# Altium project Animated Archer.PrjPCB (part 1 of 2)
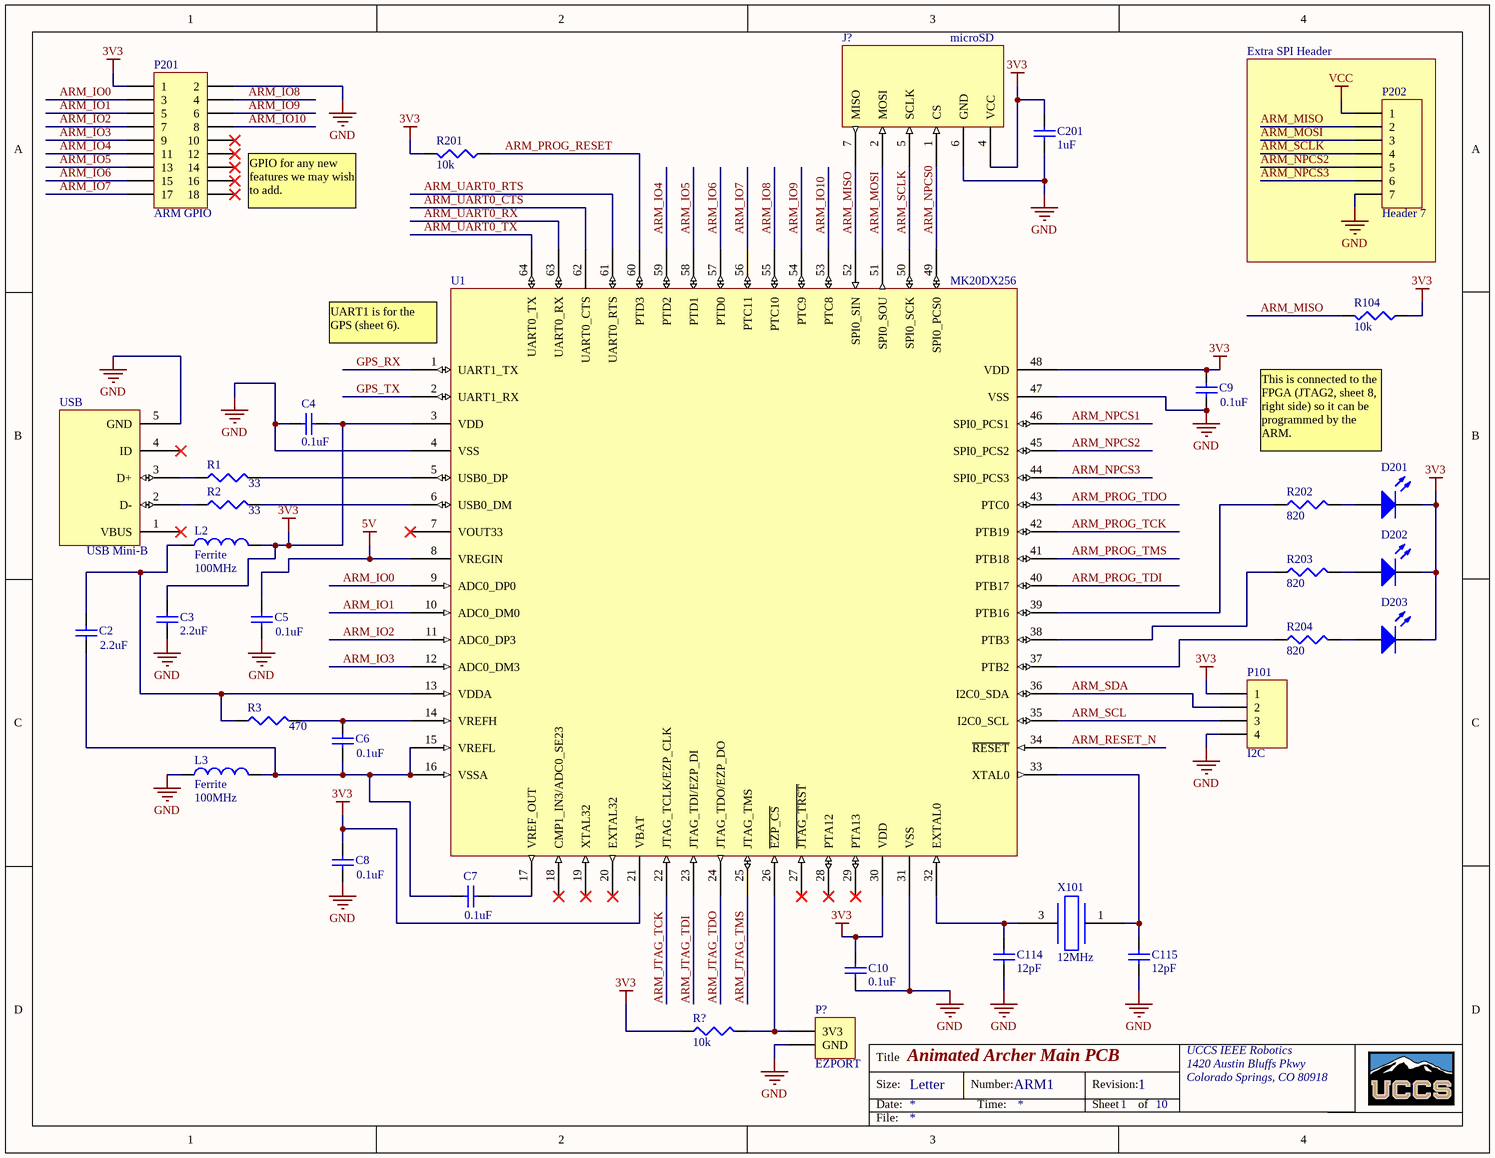
[diagram p0: ARM.SchDoc]
8 sheets, 160 parts. Net scope: global (net labels, ports and power ports of the same name join across sheets).
Board file: Animated Archer Rev1.PcbDoc
Sheets:
  ARM.SchDoc
  FPGA1.SchDoc
  FPGA2.SchDoc
  FPGA3.SchDoc
  JTAG1.SchDoc
  JTAG2.SchDoc
  POWER.SchDoc
  SRAM.SchDoc

## Sheet ARM.SchDoc: Animated Archer Main PCB
size Letter; Author: John Eric Martin; Engineer: John Eric Martin; Organization: UCCS IEEE Robotics; Address1: 1420 Austin Bluffs Pkwy; Address2: Colorado Springs, CO 80918; DocumentNumber: ARM1; Revision: 1; SheetNumber: 1; SheetTotal: 10; ProjectName: Animated Archer Quadcopter

### Parts
C2  value 2.2uF  [C0805]  (hidden comment: Cap Semi)
C3  value 2.2uF  [C0805]  (hidden comment: Cap Semi)
C4  value 0.1uF  [C0805]  (hidden comment: Cap Semi)
C5  value 0.1uF  [C0805]  (hidden comment: Cap Semi)
C6  value 0.1uF  [C0805]  (hidden comment: Cap Semi)
C7  value 0.1uF  [C0805]  (hidden comment: Cap Semi)
C8  value 0.1uF  [C0805]  (hidden comment: Cap Semi)
C9  value 0.1uF  [C0805]  (hidden comment: Cap Semi)
C10  value 0.1uF  [C0805]  (hidden comment: Cap Semi)
C114  value 12pF  [1608[0603]]  (hidden comment: 0.1uF)
C115  value 12pF  [1608[0603]]  (hidden comment: 0.1uF)
C201  value 1uF  [1608[0603]]  (hidden comment: 0.1uF)
D201  Green  [1608[0603]]  (value not drawn)
D202  Green  [1608[0603]]  (value not drawn)
D203  Green  [1608[0603]]  (value not drawn)
J101  microSD  [500873-0806]
L2  Ferrite  value 100MHz  [C0805]
L3  Ferrite  value 100MHz  [C0805]
P101  I2C  [HDR1X4]
P103  EZPORT  [HDR1X2]
P201  ARM GPIO  [HDR2X9]
P202  Header 7  [HDR1X7]
R1  value 33  [6-0805_N]  (hidden comment: Res3)
R2  value 33  [6-0805_N]  (hidden comment: Res3)
R3  value 470  [6-0805_N]  (hidden comment: Res3)
R104  value 10k  [J1-0603]  (hidden comment: Res3)
R106  value 10k  [J1-0603]  (hidden comment: Res3)
R201  value 10k  [J1-0603]  (hidden comment: Res3)
R202  value 820  [J1-0603]  (hidden comment: Res3)
R203  value 820  [J1-0603]  (hidden comment: Res3)
R204  value 820  [J1-0603]  (hidden comment: Res3)
U1  Part Number: MK20DX256  [MK20DX128VLH5]  (hidden comment: MK20DX128VLH5)
USB  USB Mini-B  [54819-0572]
X101  12MHz  [CTS405XTAL]

### Blocks framed on the sheet
Extra SPI Header: P202

### Nets
3V3: C3.2 C4.1 C8.2 C9.2 C10.2 C201.1 D201.2(K) D202.2(K) D203.2(K) J101.4(VCC) L2.2 P101.1 P201.1 R104.1 R106.1 R201.1 U1.3(VDD) U1.21(VBAT) U1.30(VDD) U1.48(VDD)  [project net CPLD_VTARGET]
5V: C5.2 U1.8(VREGIN)
GND: C3.1 C4.2 C5.1 C8.1 C9.1 C10.1 C114.1 C115.1 C201.2 J101.6(GND) L3.1 P101.4 P103.2(GND) P201.2 P202.7 U1.4(VSS) U1.31(VSS) U1.47(VSS) USB.5(GND)  [project net FPGA_SUSPEND]
VCC: P202.1
ARM_IO0: P201.3 U1.9(ADC0_DP0)
ARM_IO1: P201.5 U1.10(ADC0_DM0)
ARM_IO2: P201.7 U1.11(ADC0_DP3)
ARM_IO3: P201.9 U1.12(ADC0_DM3)
ARM_IO4: P201.11 U1.59(PTD2)
ARM_IO5: P201.13 U1.58(PTD1)
ARM_IO6: P201.15 U1.57(PTD0)
ARM_IO7: P201.17 U1.56(PTC11)
ARM_IO8: P201.4 U1.55(PTC10)
ARM_IO9: P201.6 U1.54(PTC9)
ARM_IO10: P201.8 U1.53(PTC8)
ARM_JTAG_TCK: U1.22(JTAG_TCLK/EZP_CLK)
ARM_JTAG_TDI: U1.23(JTAG_TDI/EZP_DI)
ARM_JTAG_TDO: U1.24(JTAG_TDO/EZP_DO)
ARM_JTAG_TMS: U1.25(JTAG_TMS)
ARM_MISO: J101.7(MISO) P202.2 R104.2 U1.52(SPI0_SIN)
ARM_MOSI: J101.2(MOSI) P202.3 U1.51(SPI0_SOU)
ARM_NPCS0: J101.1(CS) U1.49(SPI0_PCS0)
ARM_NPCS1: U1.46(SPI0_PCS1)
ARM_NPCS2: P202.5 U1.45(SPI0_PCS2)
ARM_NPCS3: P202.6 U1.44(SPI0_PCS3)
ARM_PROG_RESET: R201.2 U1.60(PTD3)
ARM_PROG_TCK: U1.42(PTB19)
ARM_PROG_TDI: U1.40(PTB17)
ARM_PROG_TDO: U1.43(PTC0)
ARM_PROG_TMS: U1.41(PTB18)
ARM_RESET_N: U1.34(~{RESET})
ARM_SCL: P101.3 U1.35(I2C0_SCL)
ARM_SCLK: J101.5(SCLK) P202.4 U1.50(SPI0_SCK)
ARM_SDA: P101.2 U1.36(I2C0_SDA)
ARM_UART0_CTS: U1.62(UART0_CTS)
ARM_UART0_RTS: U1.61(UART0_RTS)
ARM_UART0_RX: U1.63(UART0_RX)
ARM_UART0_TX: U1.64(UART0_TX)
GPS_RX: U1.1(UART1_TX)
GPS_TX: U1.2(UART1_RX)
NetC2_1: C2.1 C6.1 C7.2 L3.2 U1.15(VREFL) U1.16(VSSA)
NetC2_2: C2.2 L2.1 R3.1 U1.13(VDDA)
NetC6_2: C6.2 R3.2 U1.14(VREFH)
NetC7_1: C7.1 U1.17(VREF_OUT)
NetC114_2: C114.2 U1.32(EXTAL0) X101.3
NetC115_2: C115.2 U1.33(XTAL0) X101.1
NetD201_1: D201.1(A) R202.2
NetD202_1: D202.1(A) R203.2
NetD203_1: D203.1(A) R204.2
NetP103_1: P103.1(3V3) R106.2 U1.26(~{EZP_CS})
NetR1_1: R1.1 USB.3(D+)
NetR1_2: R1.2 U1.5(USB0_DP)
NetR2_1: R2.1 USB.2(D-)
NetR2_2: R2.2 U1.6(USB0_DM)
NetR202_1: R202.1 U1.39(PTB16)
NetR203_1: R203.1 U1.38(PTB3)
NetR204_1: R204.1 U1.37(PTB2)

Not connected (* = marked no-connect by the designer): P201 10* 12* 14* 16* 18*; U1 7(VOUT33)* 18(CMP1_IN3/ADC0_SE23)* 19(XTAL32)* 20(EXTAL32)* 27(~{JTAG_TRST})* 28(PTA12)* 29(PTA13)*; USB 1(VBUS)* 4(ID)* 6(CASE)

### Notes on the sheet
- (near P201) GPIO for any new features we may wish to add.
- (near U1) UART1 is for the GPS (sheet 6).
- This is connected to the FPGA (JTAG2, sheet 8, right side) so it can be programmed by the ARM.
- Title
- Size:
- Date:
- Letter
- Number:
- Time:
- Revision:
- Sheet
- of
- File:

### Library data of the parts
C2-C10 C114 C115 C201 = Cap Semi: Capacitor (Semiconductor SIM Model); Published: 8-Jun-2000; LatestRevisionDate: 29-May-2009; LatestRevisionNote: IPC-7351 Footprint Added.; PackageReference: C1206; Publisher: Altium Limited; PackageDescription: Chip Capacitor
D201-D203 = LED2: Typical RED, GREEN, YELLOW, AMBER GaAs LED; Published: 8-Jun-2000; LatestRevisionDate: 17-Jul-2002; LatestRevisionNote: Re-released for DXP Platform.; PackageVersion: Feb-2002; PackageReference: 3.2X1.6X1.1; Publisher: Altium Limited; PackageDescription: SM LED; 2 Flat Leads
J101 = 500873-0806: microSD Memory Card Connector
L2 L3 = Inductor: Code_IEC: 1005; Published: 8-Jun-2000; LatestRevisionDate: 29-May-2009; LatestRevisionNote: IPC-7351 Footprint Added.; PackageReference: 0402-A; Publisher: Altium Limited; PackageDescription: Chip Inductor; Code_JEITA: 0402
P101 = Header 4: Header, 4-Pin; LatestRevisionDate: 17-Jul-2002; LatestRevisionNote: Re-released for DXP Platform.; Publisher: Altium Limited
P103 = Header 2: Header, 2-Pin
P201 = Header 9X2: Header, 9-Pin, Dual row; LatestRevisionDate: 17-Jul-2002; LatestRevisionNote: Re-released for DXP Platform.; Publisher: Altium Limited
P202 = Header 7: Header, 7-Pin; LatestRevisionDate: 17-Jul-2002; LatestRevisionNote: Re-released for DXP Platform.; Publisher: Altium Limited
R1-R3 R104 R106 R201-R204 = Res3: Resistor
U1 = MK20DX128VLH5: Freescale ARM Cortex-M4; Supplier 1: Digi-Key; Supplier 2: Newark; Supplier 3: Mouser; Supplier Part Number 1: MK20DX128VLH5-ND; Supplier Part Number 2: 24W6502; Supplier Part Number 3: 841-MK20DX128VLH5
USB = USB Mini-B: 54819-0572
X101 = CTS405XTAL: CTS 405 Surface Mount Quartz Crystal (405C35B12M00000); Supplier 1: Mouser; Supplier 2: Digi-Key; Supplier 3: Digi-Key; Supplier 4: Arrow; Supplier 5: Digi-Key

## Sheet FPGA1.SchDoc: Animated Archer Main PCB
size Letter; Author: John Eric Martin; Engineer: John Eric Martin; Organization: UCCS IEEE Robotics; Address1: 1420 Austin Bluffs Pkwy; Address2: Colorado Springs, CO 80918; DocumentNumber: FPGA1; Revision: 1; SheetNumber: 3; SheetTotal: 10; ProjectName: Animated Archer Quadcopter
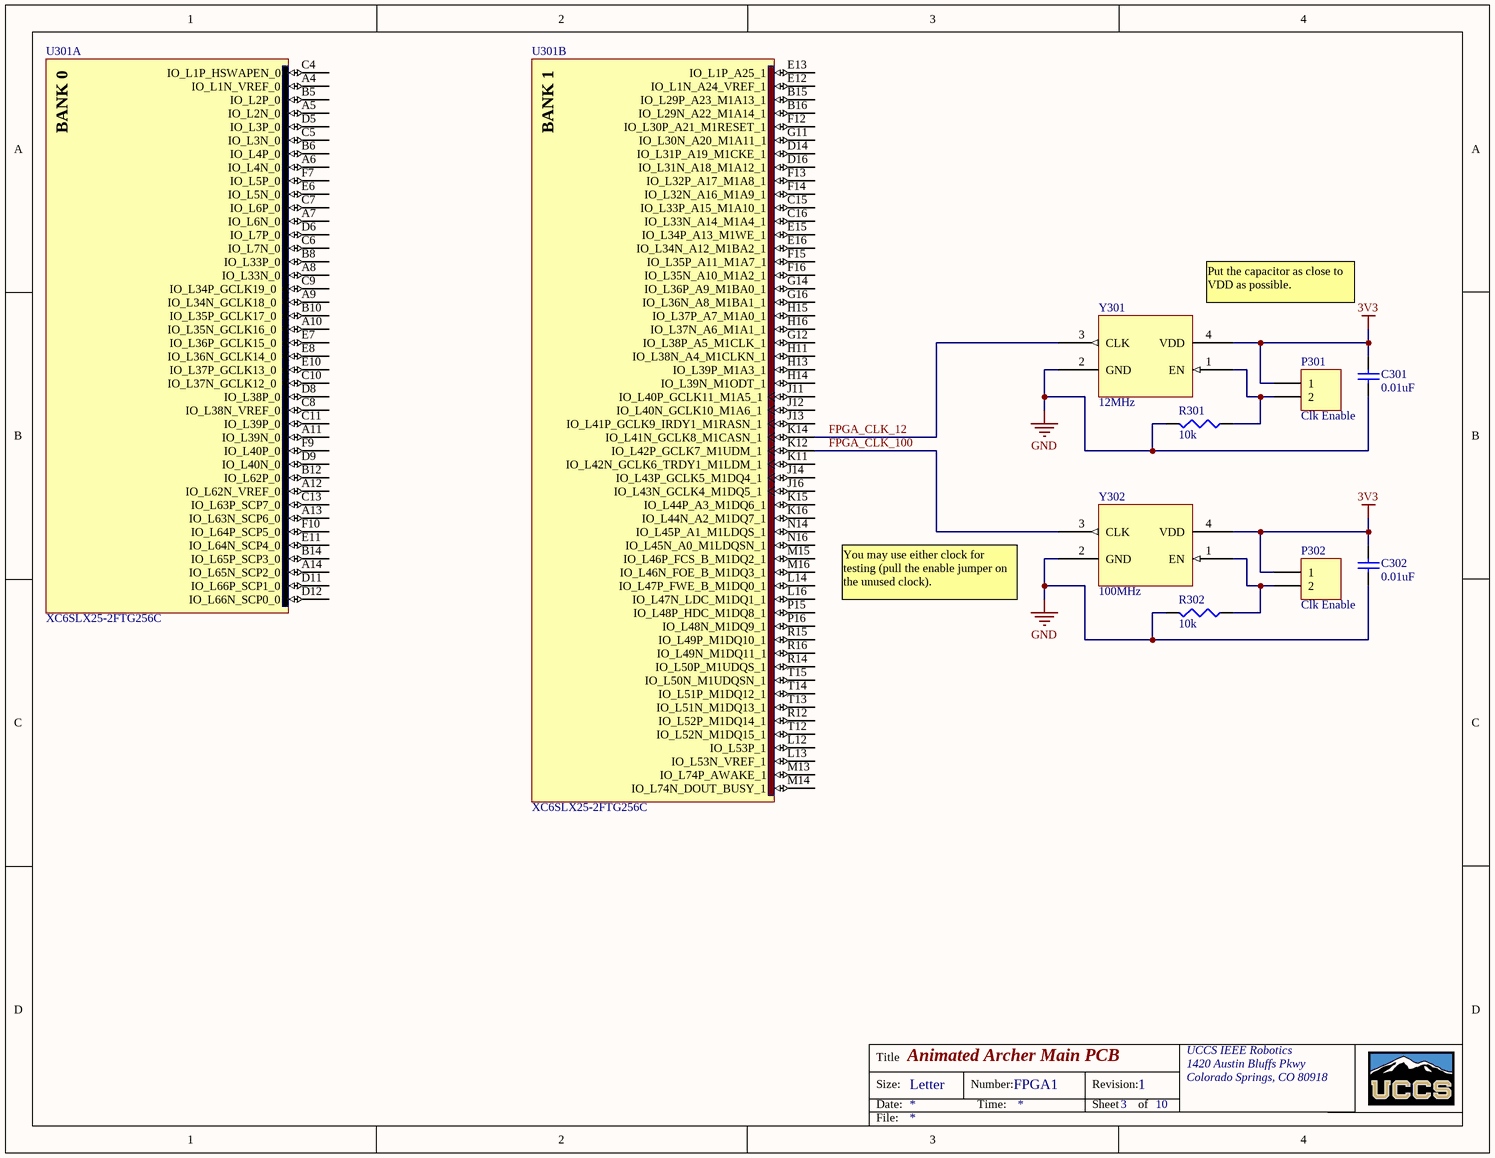
[diagram p1: FPGA1.SchDoc]

### Parts
C301  value 0.01uF  [1608[0603]]  (hidden comment: Cap Semi)
C302  value 0.01uF  [1608[0603]]  (hidden comment: Cap Semi)
P301  Clk Enable  [HDR1X2]
P302  Clk Enable  [HDR1X2]
R301  value 10k  [J1-0603]  (hidden comment: Res3)
R302  value 10k  [J1-0603]  (hidden comment: Res3)
U301  XC6SLX25-2FTG256C  [FTG256]  (parts A,B of 7)
Y301  12MHz  [ASFLMB]
Y302  100MHz  [ASFLMB]

### Nets
3V3: C301.2 C302.2 P301.1 P302.1 Y301.4(VDD) Y302.4(VDD)  [project net CPLD_VTARGET]
GND: C301.1 C302.1 R301.2 R302.2 Y301.2(GND) Y302.2(GND)  [project net FPGA_SUSPEND]
FPGA_CLK_12: U301.K14(IO_L41N_GCLK8_M1CASN_1) Y301.3(CLK)
FPGA_CLK_100: U301.K12(IO_L42P_GCLK7_M1UDM_1) Y302.3(CLK)
NetP301_2: P301.2 R301.1 Y301.1(EN)
NetP302_2: P302.2 R302.1 Y302.1(EN)

Not connected (* = marked no-connect by the designer): U301 A4(IO_L1N_VREF_0) A5(IO_L2N_0) A6(IO_L4N_0) A7(IO_L6N_0) A8(IO_L33N_0) A9(IO_L34N_GCLK18_0) A10(IO_L35N_GCLK16_0) A11(IO_L39N_0) A12(IO_L62N_VREF_0) A13(IO_L63N_SCP6_0) A14(IO_L65N_SCP2_0) B5(IO_L2P_0) B6(IO_L4P_0) B8(IO_L33P_0) B10(IO_L35P_GCLK17_0) B12(IO_L62P_0) B14(IO_L65P_SCP3_0) B15(IO_L29P_A23_M1A13_1) B16(IO_L29N_A22_M1A14_1) C4(IO_L1P_HSWAPEN_0) C5(IO_L3N_0) C6(IO_L7N_0) C7(IO_L6P_0) C8(IO_L38N_VREF_0) C9(IO_L34P_GCLK19_0) C10(IO_L37N_GCLK12_0) C11(IO_L39P_0) C13(IO_L63P_SCP7_0) C15(IO_L33P_A15_M1A10_1) C16(IO_L33N_A14_M1A4_1) D5(IO_L3P_0) D6(IO_L7P_0) D8(IO_L38P_0) D9(IO_L40N_0) D11(IO_L66P_SCP1_0) D12(IO_L66N_SCP0_0) D14(IO_L31P_A19_M1CKE_1) D16(IO_L31N_A18_M1A12_1) E6(IO_L5N_0) E7(IO_L36P_GCLK15_0) E8(IO_L36N_GCLK14_0) E10(IO_L37P_GCLK13_0) E11(IO_L64N_SCP4_0) E12(IO_L1N_A24_VREF_1) E13(IO_L1P_A25_1) E15(IO_L34P_A13_M1WE_1) E16(IO_L34N_A12_M1BA2_1) F7(IO_L5P_0) F9(IO_L40P_0) F10(IO_L64P_SCP5_0) F12(IO_L30P_A21_M1RESET_1) F13(IO_L32P_A17_M1A8_1) F14(IO_L32N_A16_M1A9_1) F15(IO_L35P_A11_M1A7_1) F16(IO_L35N_A10_M1A2_1) G11(IO_L30N_A20_M1A11_1) G12(IO_L38P_A5_M1CLK_1) G14(IO_L36P_A9_M1BA0_1) G16(IO_L36N_A8_M1BA1_1) H11(IO_L38N_A4_M1CLKN_1) H13(IO_L39P_M1A3_1) H14(IO_L39N_M1ODT_1) H15(IO_L37P_A7_M1A0_1) H16(IO_L37N_A6_M1A1_1) J11(IO_L40P_GCLK11_M1A5_1) J12(IO_L40N_GCLK10_M1A6_1) J13(IO_L41P_GCLK9_IRDY1_M1RASN_1) J14(IO_L43P_GCLK5_M1DQ4_1) J16(IO_L43N_GCLK4_M1DQ5_1) K11(IO_L42N_GCLK6_TRDY1_M1LDM_1) K15(IO_L44P_A3_M1DQ6_1) K16(IO_L44N_A2_M1DQ7_1) L12(IO_L53P_1) L13(IO_L53N_VREF_1) L14(IO_L47P_FWE_B_M1DQ0_1) L16(IO_L47N_LDC_M1DQ1_1) M13(IO_L74P_AWAKE_1) M14(IO_L74N_DOUT_BUSY_1) M15(IO_L46P_FCS_B_M1DQ2_1) M16(IO_L46N_FOE_B_M1DQ3_1) N14(IO_L45P_A1_M1LDQS_1) N16(IO_L45N_A0_M1LDQSN_1) P15(IO_L48P_HDC_M1DQ8_1) P16(IO_L48N_M1DQ9_1) R12(IO_L52P_M1DQ14_1) R14(IO_L50P_M1UDQS_1) R15(IO_L49P_M1DQ10_1) R16(IO_L49N_M1DQ11_1) T12(IO_L52N_M1DQ15_1) T13(IO_L51N_M1DQ13_1) T14(IO_L51P_M1DQ12_1) T15(IO_L50N_M1UDQSN_1)

### Notes on the sheet
- (near Y301) Put the capacitor as close to VDD as possible.
- You may use either clock for testing (pull the enable jumper on the unused clock).
- Title
- Size:
- Date:
- Letter
- Number:
- Time:
- Revision:
- Sheet
- of
- File:
- (in symbol XC6SLX25-2FTG256C, part A) BANK 0
- (in symbol XC6SLX25-2FTG256C, part B) BANK 1

### Library data of the parts
C301 C302 = Cap Semi: Capacitor (Semiconductor SIM Model); Published: 8-Jun-2000; LatestRevisionDate: 29-May-2009; LatestRevisionNote: IPC-7351 Footprint Added.; PackageReference: C1206; Publisher: Altium Limited; PackageDescription: Chip Capacitor
P301 P302 = Header 2: Header, 2-Pin; LatestRevisionDate: 17-Jul-2002; LatestRevisionNote: Re-released for DXP Platform.; Publisher: Altium Limited
R301 R302 = Res3: Resistor; Published: 8-Jun-2000; LatestRevisionDate: 29-May-2009; LatestRevisionNote: IPC-7351 Footprint Added.; PackageReference: J1-0603; Publisher: Altium Limited; PackageDescription: Chip Resistor
U301 = XC6SLX25-2FTG256C: Spartan-6 LX 1.2V FPGA, 186 User I/Os, 256-Ball Fine-Pitch Thin BGA (1.0mm Pitch), Speed Grade 2, Commercial Grade, Pb-Free; Published: 17-Nov-2009; DatasheetVersion: ver1.6, Nov-2010; PackageVersion: ver1.3, Oct-2007; PackageReference: FTG256; Publisher: Altium Limited; PackageDescription: 256-Ball Fine Pitch Thin Ball Grid Array 1.00 mm Pitch (FTG256) - Pb-Free; Supplier 1: Digi-Key; Supplier Part Number 1: XC6SLX25-2FTG256C-ND; Code_JEDEC: MS-034-AAF-1*; ComponentLink1Description: Manufacturer Link; ComponentLink1URL: http://www.xilinx.com; ComponentLink2Description: Spartan-6 Datasheet; ComponentLink2URL: http://www.xilinx.com/support/documentation/data_sheets/ds160.pdf; ComponentLink3Description: Spartan-6 Documents; ComponentLink3URL: http://www.xilinx.com/support/documentation/spartan-6.htm; ComponentLink4Description: Xilinx.com Home; ComponentLink4URL: http://www.xilinx.com
Y301 Y302 = ASFLMB: ASFLMB Clock Oscillator

## Sheet FPGA2.SchDoc: Animated Archer Main PCB
size Letter; Author: John Eric Martin; Engineer: John Eric Martin; Organization: UCCS IEEE Robotics; Address1: 1420 Austin Bluffs Pkwy; Address2: Colorado Springs, CO 80918; DocumentNumber: FPGA2; Revision: 1; SheetNumber: 4; SheetTotal: 10; ProjectName: Animated Archer Quadcopter
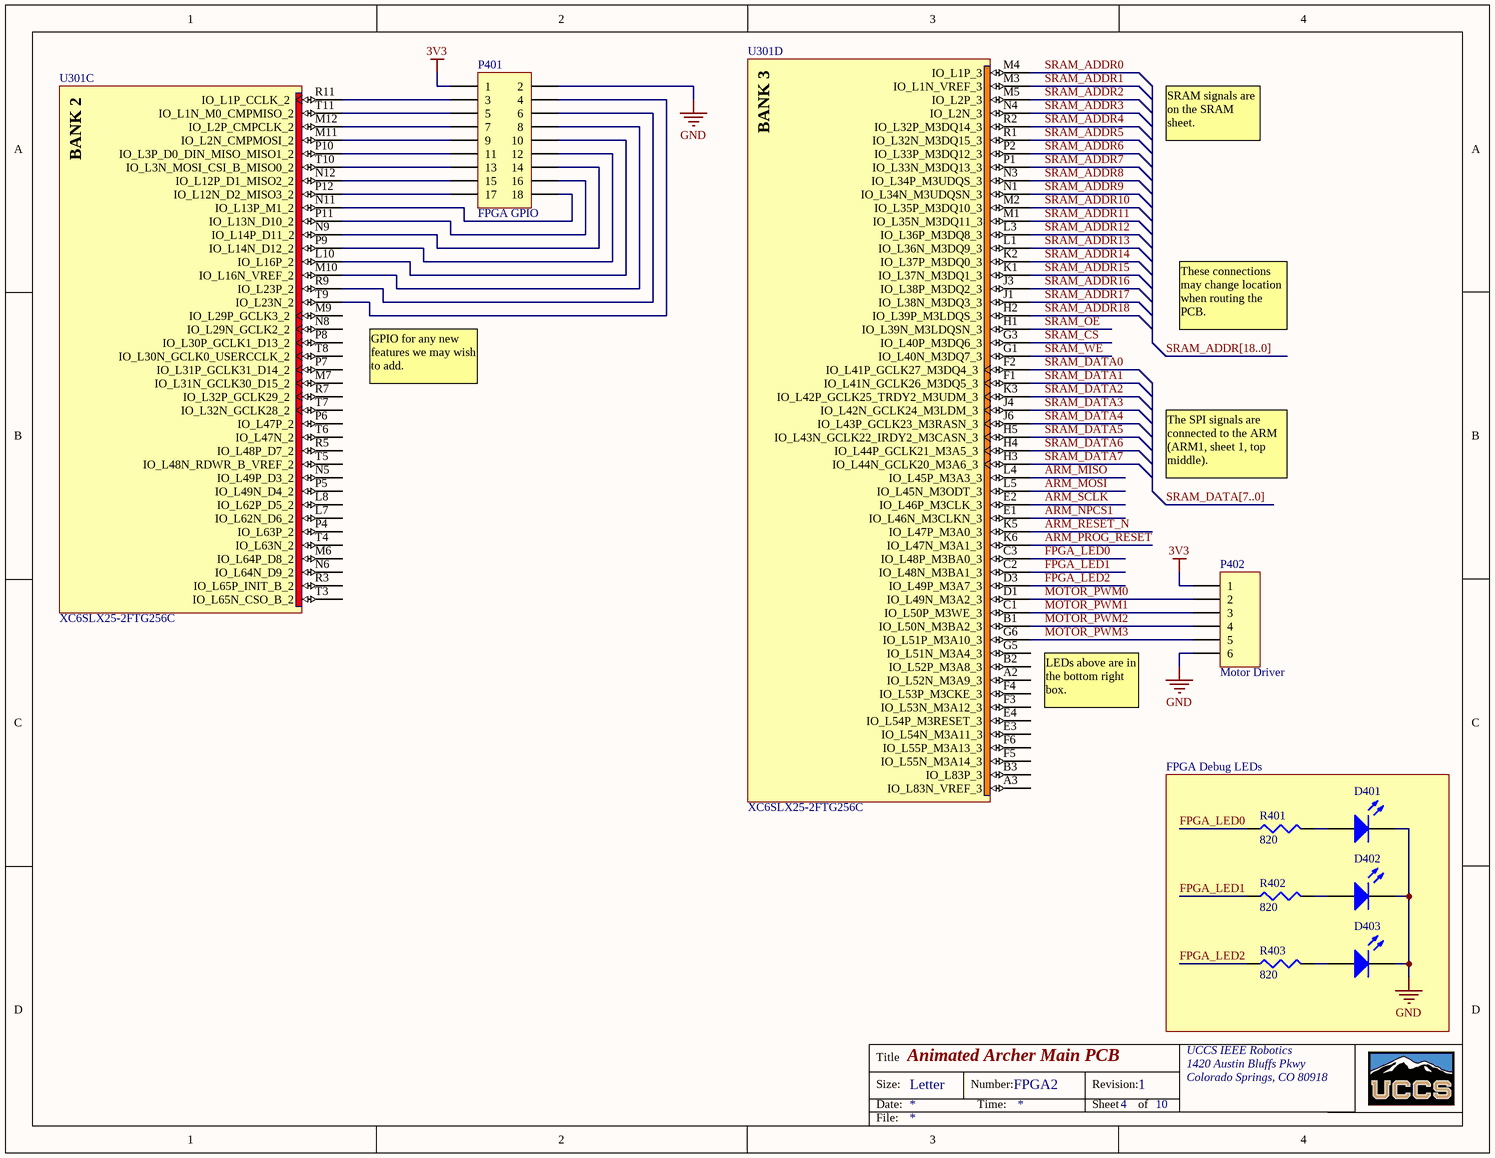
[diagram p2: FPGA2.SchDoc]

### Parts
D401  Green  [1608[0603]]  (value not drawn)
D402  Green  [1608[0603]]  (value not drawn)
D403  Green  [1608[0603]]  (value not drawn)
P401  FPGA GPIO  [HDR2X9]
P402  Motor Driver  [HDR1X6]
R401  value 820  [J1-0603]  (hidden comment: Res3)
R402  value 820  [J1-0603]  (hidden comment: Res3)
R403  value 820  [J1-0603]  (hidden comment: Res3)
U301  XC6SLX25-2FTG256C  [FTG256]  (parts C,D of 7)

### Blocks framed on the sheet
FPGA Debug LEDs: D401-D403 R401-R403

### Nets
3V3: P401.1 P402.1  [project net CPLD_VTARGET]
GND: D401.2(K) D402.2(K) D403.2(K) P401.2 P402.6  [project net FPGA_SUSPEND]
ARM_MISO: U301.L4(IO_L45P_M3A3_3)
ARM_MOSI: U301.L5(IO_L45N_M3ODT_3)
ARM_NPCS1: U301.E1(IO_L46N_M3CLKN_3)
ARM_PROG_RESET: U301.K6(IO_L47N_M3A1_3)
ARM_RESET_N: U301.K5(IO_L47P_M3A0_3)
ARM_SCLK: U301.E2(IO_L46P_M3CLK_3)
FPGA_LED0: R401.1 U301.C3(IO_L48P_M3BA0_3)
FPGA_LED1: R402.1 U301.C2(IO_L48N_M3BA1_3)
FPGA_LED2: R403.1 U301.D3(IO_L49P_M3A7_3)
MOTOR_PWM0: P402.2 U301.D1(IO_L49N_M3A2_3)
MOTOR_PWM1: P402.3 U301.C1(IO_L50P_M3WE_3)
MOTOR_PWM2: P402.4 U301.B1(IO_L50N_M3BA2_3)
MOTOR_PWM3: P402.5 U301.G6(IO_L51P_M3A10_3)
SRAM_ADDR0: U301.M4(IO_L1P_3)
SRAM_ADDR1: U301.M3(IO_L1N_VREF_3)
SRAM_ADDR2: U301.M5(IO_L2P_3)
SRAM_ADDR3: U301.N4(IO_L2N_3)
SRAM_ADDR4: U301.R2(IO_L32P_M3DQ14_3)
SRAM_ADDR5: U301.R1(IO_L32N_M3DQ15_3)
SRAM_ADDR6: U301.P2(IO_L33P_M3DQ12_3)
SRAM_ADDR7: U301.P1(IO_L33N_M3DQ13_3)
SRAM_ADDR8: U301.N3(IO_L34P_M3UDQS_3)
SRAM_ADDR9: U301.N1(IO_L34N_M3UDQSN_3)
SRAM_ADDR10: U301.M2(IO_L35P_M3DQ10_3)
SRAM_ADDR11: U301.M1(IO_L35N_M3DQ11_3)
SRAM_ADDR12: U301.L3(IO_L36P_M3DQ8_3)
SRAM_ADDR13: U301.L1(IO_L36N_M3DQ9_3)
SRAM_ADDR14: U301.K2(IO_L37P_M3DQ0_3)
SRAM_ADDR15: U301.K1(IO_L37N_M3DQ1_3)
SRAM_ADDR16: U301.J3(IO_L38P_M3DQ2_3)
SRAM_ADDR17: U301.J1(IO_L38N_M3DQ3_3)
SRAM_ADDR18: U301.H2(IO_L39P_M3LDQS_3)
SRAM_CS: U301.G3(IO_L40P_M3DQ6_3)
SRAM_DATA0: U301.F2(IO_L41P_GCLK27_M3DQ4_3)
SRAM_DATA1: U301.F1(IO_L41N_GCLK26_M3DQ5_3)
SRAM_DATA2: U301.K3(IO_L42P_GCLK25_TRDY2_M3UDM_3)
SRAM_DATA3: U301.J4(IO_L42N_GCLK24_M3LDM_3)
SRAM_DATA4: U301.J6(IO_L43P_GCLK23_M3RASN_3)
SRAM_DATA5: U301.H5(IO_L43N_GCLK22_IRDY2_M3CASN_3)
SRAM_DATA6: U301.H4(IO_L44P_GCLK21_M3A5_3)
SRAM_DATA7: U301.H3(IO_L44N_GCLK20_M3A6_3)
SRAM_OE: U301.H1(IO_L39N_M3LDQSN_3)
SRAM_WE: U301.G1(IO_L40N_M3DQ7_3)
NetD401_1: D401.1(A) R401.2
NetD402_1: D402.1(A) R402.2
NetD403_1: D403.1(A) R403.2
NetP401_3: P401.3 U301.R11(IO_L1P_CCLK_2)
NetP401_4: P401.4 U301.T9(IO_L23N_2)
NetP401_5: P401.5 U301.T11(IO_L1N_M0_CMPMISO_2)
NetP401_6: P401.6 U301.R9(IO_L23P_2)
NetP401_7: P401.7 U301.M12(IO_L2P_CMPCLK_2)
NetP401_8: P401.8 U301.M10(IO_L16N_VREF_2)
NetP401_9: P401.9 U301.M11(IO_L2N_CMPMOSI_2)
NetP401_10: P401.10 U301.L10(IO_L16P_2)
NetP401_11: P401.11 U301.P10(IO_L3P_D0_DIN_MISO_MISO1_2)
NetP401_12: P401.12 U301.P9(IO_L14N_D12_2)
NetP401_13: P401.13 U301.T10(IO_L3N_MOSI_CSI_B_MISO0_2)
NetP401_14: P401.14 U301.N9(IO_L14P_D11_2)
NetP401_15: P401.15 U301.N12(IO_L12P_D1_MISO2_2)
NetP401_16: P401.16 U301.P11(IO_L13N_D10_2)
NetP401_17: P401.17 U301.P12(IO_L12N_D2_MISO3_2)
NetP401_18: P401.18 U301.N11(IO_L13P_M1_2)

Not connected (* = marked no-connect by the designer): U301 A2(IO_L52N_M3A9_3) A3(IO_L83N_VREF_3) B2(IO_L52P_M3A8_3) B3(IO_L83P_3) E3(IO_L54N_M3A11_3) E4(IO_L54P_M3RESET_3) F3(IO_L53N_M3A12_3) F4(IO_L53P_M3CKE_3) F5(IO_L55N_M3A14_3) F6(IO_L55P_M3A13_3) G5(IO_L51N_M3A4_3) L7(IO_L62N_D6_2) L8(IO_L62P_D5_2) M6(IO_L64P_D8_2) M7(IO_L31N_GCLK30_D15_2) M9(IO_L29P_GCLK3_2) N5(IO_L49P_D3_2) N6(IO_L64N_D9_2) N8(IO_L29N_GCLK2_2) P4(IO_L63P_2) P5(IO_L49N_D4_2) P6(IO_L47P_2) P7(IO_L31P_GCLK31_D14_2) P8(IO_L30P_GCLK1_D13_2) R3(IO_L65P_INIT_B_2) R5(IO_L48P_D7_2) R7(IO_L32P_GCLK29_2) T3(IO_L65N_CSO_B_2) T4(IO_L63N_2) T5(IO_L48N_RDWR_B_VREF_2) T6(IO_L47N_2) T7(IO_L32N_GCLK28_2) T8(IO_L30N_GCLK0_USERCCLK_2)

### Buses and harness runs
bus SRAM_ADDR[18..0]
bus SRAM_DATA[7..0]

### Notes on the sheet
- SRAM signals are on the SRAM sheet.
- These connections may change location when routing the PCB.
- GPIO for any new features we may wish to add.
- The SPI signals are connected to the ARM (ARM1, sheet 1, top middle).
- LEDs above are in the bottom right box.
- Title
- Size:
- Date:
- Letter
- Number:
- Time:
- Revision:
- Sheet
- of
- File:
- (in symbol XC6SLX25-2FTG256C, part C) BANK 2
- (in symbol XC6SLX25-2FTG256C, part D) BANK 3

### Library data of the parts
D401-D403 = LED2: as D201 on sheet ARM; Published: 8-Jun-2000; LatestRevisionDate: 17-Jul-2002; LatestRevisionNote: Re-released for DXP Platform.; PackageVersion: Feb-2002; PackageReference: 3.2X1.6X1.1; Publisher: Altium Limited; PackageDescription: SM LED; 2 Flat Leads
P401 = Header 9X2: Header, 9-Pin, Dual row; LatestRevisionDate: 17-Jul-2002; LatestRevisionNote: Re-released for DXP Platform.; Publisher: Altium Limited
P402 = Header 6: Header, 6-Pin; LatestRevisionDate: 17-Jul-2002; LatestRevisionNote: Re-released for DXP Platform.; Publisher: Altium Limited
R401-R403 = Res3: Resistor; Published: 8-Jun-2000; LatestRevisionDate: 29-May-2009; LatestRevisionNote: IPC-7351 Footprint Added.; PackageReference: J1-0603; Publisher: Altium Limited; PackageDescription: Chip Resistor
U301 = XC6SLX25-2FTG256C: as U301 on sheet FPGA1; Published: 17-Nov-2009; DatasheetVersion: ver1.6, Nov-2010; PackageVersion: ver1.3, Oct-2007; PackageReference: FTG256; Publisher: Altium Limited; PackageDescription: 256-Ball Fine Pitch Thin Ball Grid Array 1.00 mm Pitch (FTG256) - Pb-Free; Supplier 1: Digi-Key; Supplier Part Number 1: XC6SLX25-2FTG256C-ND; Code_JEDEC: MS-034-AAF-1*; ComponentLink1Description: Manufacturer Link; ComponentLink1URL: http://www.xilinx.com; ComponentLink2Description: Spartan-6 Datasheet; ComponentLink2URL: http://www.xilinx.com/support/documentation/data_sheets/ds160.pdf; ComponentLink3Description: Spartan-6 Documents; ComponentLink3URL: http://www.xilinx.com/support/documentation/spartan-6.htm; ComponentLink4Description: Xilinx.com Home; ComponentLink4URL: http://www.xilinx.com

## Sheet FPGA3.SchDoc: Animated Archer Main PCB
size Letter; Author: John Eric Martin; Engineer: John Eric Martin; Organization: UCCS IEEE Robotics; Address1: 1420 Austin Bluffs Pkwy; Address2: Colorado Springs, CO 80918; DocumentNumber: FPGA3; Revision: 1; SheetNumber: 5; SheetTotal: 10; ProjectName: Animated Archer Quadcopter
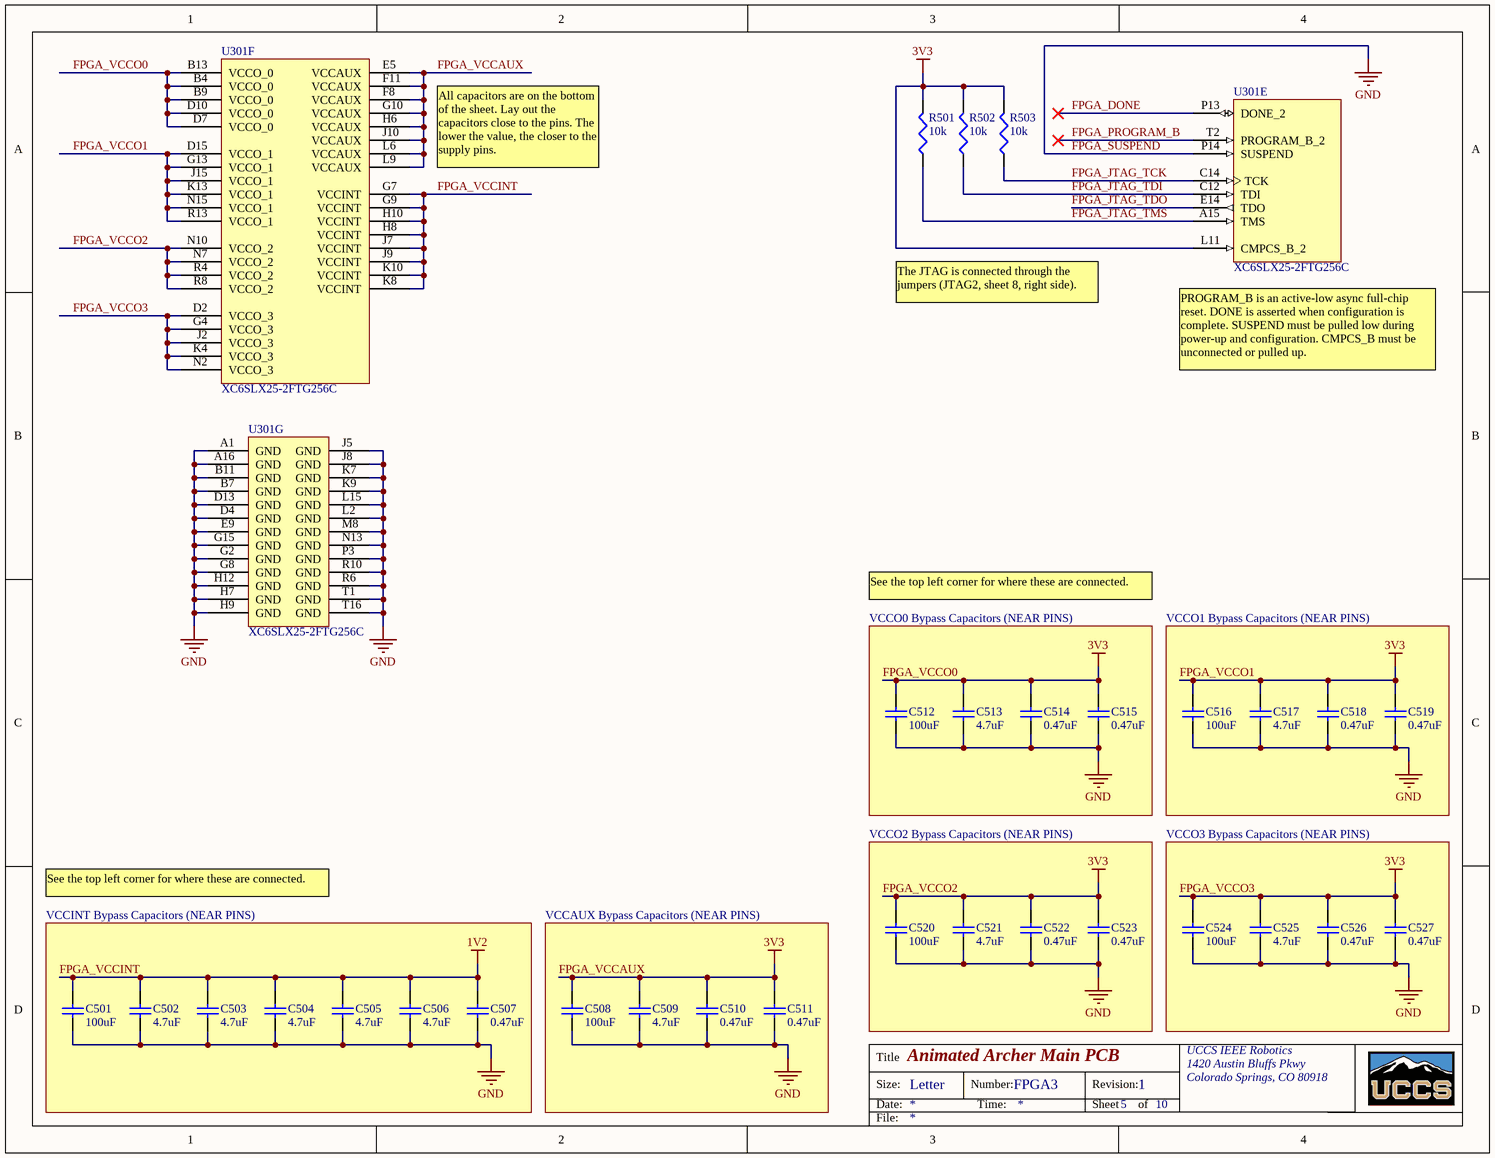
[diagram p3: FPGA3.SchDoc]

### Parts
(Parts that share a designator on the sheet are numbered #1, #2 ... from top to bottom, then left to right.)
C501#1  value 100uF  [1608[0603]]  (hidden comment: 0.1uF)
C502#1  value 4.7uF  [1608[0603]]  (hidden comment: 0.1uF)
C503#1  value 4.7uF  [1608[0603]]  (hidden comment: 0.1uF)
C504#1  value 4.7uF  [1608[0603]]  (hidden comment: 0.1uF)
C505#1  value 4.7uF  [1608[0603]]  (hidden comment: 0.1uF)
C506#1  value 4.7uF  [1608[0603]]  (hidden comment: 0.1uF)
C507#1  value 0.47uF  [1608[0603]]  (hidden comment: 0.1uF)
C508#1  value 100uF  [1608[0603]]  (hidden comment: 0.1uF)
C509#1  value 4.7uF  [1608[0603]]  (hidden comment: 0.1uF)
C510#1  value 0.47uF  [1608[0603]]  (hidden comment: 0.1uF)
C511#1  value 0.47uF  [1608[0603]]  (hidden comment: 0.1uF)
C512#1  value 100uF  [1608[0603]]  (hidden comment: 0.1uF)
C513#1  value 4.7uF  [1608[0603]]  (hidden comment: 0.1uF)
C514#1  value 0.47uF  [1608[0603]]  (hidden comment: 0.1uF)
C515#1  value 0.47uF  [1608[0603]]  (hidden comment: 0.1uF)
C516#1  value 100uF  [1608[0603]]  (hidden comment: 0.1uF)
C517#1  value 4.7uF  [1608[0603]]  (hidden comment: 0.1uF)
C518  value 0.47uF  [1608[0603]]  (hidden comment: 0.1uF)
C519  value 0.47uF  [1608[0603]]  (hidden comment: 0.1uF)
C520  value 100uF  [1608[0603]]  (hidden comment: 0.1uF)
C521  value 4.7uF  [1608[0603]]  (hidden comment: 0.1uF)
C522  value 0.47uF  [1608[0603]]  (hidden comment: 0.1uF)
C523  value 0.47uF  [1608[0603]]  (hidden comment: 0.1uF)
C524  value 100uF  [1608[0603]]  (hidden comment: 0.1uF)
C525  value 4.7uF  [1608[0603]]  (hidden comment: 0.1uF)
C526  value 0.47uF  [1608[0603]]  (hidden comment: 0.1uF)
C527  value 0.47uF  [1608[0603]]  (hidden comment: 0.1uF)
R501#1  value 10k  [J1-0603]  (hidden comment: Res3)
R502#1  value 10k  [J1-0603]  (hidden comment: Res3)
R503#1  value 10k  [J1-0603]  (hidden comment: Res3)
U301  XC6SLX25-2FTG256C  [FTG256]  (parts E,F,G of 7)

### Blocks framed on the sheet
VCCO0 Bypass Capacitors (NEAR PINS): C512#1 C513#1 C514#1 C515#1
VCCO1 Bypass Capacitors (NEAR PINS): C516#1 C517#1 C518 C519
VCCO2 Bypass Capacitors (NEAR PINS): C520-C523
VCCO3 Bypass Capacitors (NEAR PINS): C524-C527
VCCINT Bypass Capacitors (NEAR PINS): C501#1 C502#1 C503#1 C504#1 C505#1 C506#1 C507#1
VCCAUX Bypass Capacitors (NEAR PINS): C508#1 C509#1 C510#1 C511#1

### Nets
3V3: C508#1.2 C509#1.2 C510#1.2 C511#1.2 C512#1.2 C513#1.2 C514#1.2 C515#1.2 C516#1.2 C517#1.2 C518.2 C519.2 C520.2 C521.2 C522.2 C523.2 C524.2 C525.2 C526.2 C527.2 R501#1.2 R502#1.2 R503#1.2 U301.B4(VCCO_0) U301.B9(VCCO_0) U301.B13(VCCO_0) U301.D2(VCCO_3) U301.D7(VCCO_0) U301.D10(VCCO_0) U301.D15(VCCO_1) U301.E5(VCCAUX) U301.F8(VCCAUX) U301.F11(VCCAUX) U301.G4(VCCO_3) U301.G10(VCCAUX) U301.G13(VCCO_1) U301.H6(VCCAUX) U301.J2(VCCO_3) U301.J10(VCCAUX) U301.J15(VCCO_1) U301.K4(VCCO_3) U301.K13(VCCO_1) U301.L6(VCCAUX) U301.L9(VCCAUX) U301.L11(CMPCS_B_2) U301.N2(VCCO_3) U301.N7(VCCO_2) U301.N10(VCCO_2) U301.N15(VCCO_1) U301.R4(VCCO_2) U301.R8(VCCO_2) U301.R13(VCCO_1)  [also labelled FPGA_VCCAUX, FPGA_VCCO0, FPGA_VCCO1, FPGA_VCCO2, FPGA_VCCO3]  [project net CPLD_VTARGET]
FPGA_SUSPEND: C501#1.1 C502#1.1 C503#1.1 C504#1.1 C505#1.1 C506#1.1 C507#1.1 C508#1.1 C509#1.1 C510#1.1 C511#1.1 C512#1.1 C513#1.1 C514#1.1 C515#1.1 C516#1.1 C517#1.1 C518.1 C519.1 C520.1 C521.1 C522.1 C523.1 C524.1 C525.1 C526.1 C527.1 U301.A1(GND) U301.A16(GND) U301.B7(GND) U301.B11(GND) U301.D4(GND) U301.D13(GND) U301.E9(GND) U301.G2(GND) U301.G8(GND) U301.G15(GND) U301.H7(GND) U301.H9(GND) U301.H12(GND) U301.J5(GND) U301.J8(GND) U301.K7(GND) U301.K9(GND) U301.L2(GND) U301.L15(GND) U301.M8(GND) U301.N13(GND) U301.P3(GND) U301.P14(SUSPEND) U301.R6(GND) U301.R10(GND) U301.T1(GND) U301.T16(GND)  [also labelled GND]
FPGA_VCCINT: C501#1.2 C502#1.2 C503#1.2 C504#1.2 C505#1.2 C506#1.2 C507#1.2 U301.G7(VCCINT) U301.G9(VCCINT) U301.H8(VCCINT) U301.H10(VCCINT) U301.J7(VCCINT) U301.J9(VCCINT) U301.K8(VCCINT) U301.K10(VCCINT)  [also labelled 1V2]
FPGA_DONE: U301.P13(DONE_2)
FPGA_JTAG_TCK: R503#1.1 U301.C14(TCK)
FPGA_JTAG_TDI: R502#1.1 U301.C12(TDI)
FPGA_JTAG_TDO: U301.E14(TDO)
FPGA_JTAG_TMS: R501#1.1 U301.A15(TMS)
FPGA_PROGRAM_B: U301.T2(PROGRAM_B_2)

### Notes on the sheet
- All capacitors are on the bottom of the sheet. Lay out the capacitors close to the pins. The lower the value, the closer to the supply pins.
- The JTAG is connected through the jumpers (JTAG2, sheet 8, right side).
- (near U301) PROGRAM_B is an active-low async full-chip reset. DONE is asserted when configuration is complete. SUSPEND must be pulled low during power-up and configuration. CMPCS_B must be unconnected or pulled up.
- See the top left corner for where these are connected.
- Title
- Size:
- Date:
- Letter
- Number:
- Time:
- Revision:
- Sheet
- of
- File:

### Library data of the parts
C501#1 C502#1 C503#1 C504#1 C505#1 C506#1 C507#1 C508#1 C509#1 C510#1 C511#1 C512#1 C513#1 C514#1 C515#1 C516#1 C517#1 C518-C527 = Cap Semi: Capacitor (Semiconductor SIM Model); Published: 8-Jun-2000; LatestRevisionDate: 29-May-2009; LatestRevisionNote: IPC-7351 Footprint Added.; PackageReference: C1206; Publisher: Altium Limited; PackageDescription: Chip Capacitor
R501#1 R502#1 R503#1 = Res3: Resistor; Published: 8-Jun-2000; LatestRevisionDate: 29-May-2009; LatestRevisionNote: IPC-7351 Footprint Added.; PackageReference: J1-0603; Publisher: Altium Limited; PackageDescription: Chip Resistor
U301 = XC6SLX25-2FTG256C: as U301 on sheet FPGA1; Published: 17-Nov-2009; DatasheetVersion: ver1.6, Nov-2010; PackageVersion: ver1.3, Oct-2007; PackageReference: FTG256; Publisher: Altium Limited; PackageDescription: 256-Ball Fine Pitch Thin Ball Grid Array 1.00 mm Pitch (FTG256) - Pb-Free; Supplier 1: Digi-Key; Supplier Part Number 1: XC6SLX25-2FTG256C-ND; Code_JEDEC: MS-034-AAF-1*; ComponentLink1Description: Manufacturer Link; ComponentLink1URL: http://www.xilinx.com; ComponentLink2Description: Spartan-6 Datasheet; ComponentLink2URL: http://www.xilinx.com/support/documentation/data_sheets/ds160.pdf; ComponentLink3Description: Spartan-6 Documents; ComponentLink3URL: http://www.xilinx.com/support/documentation/spartan-6.htm; ComponentLink4Description: Xilinx.com Home; ComponentLink4URL: http://www.xilinx.com

## Sheet JTAG1.SchDoc: Animated Archer Main PCB
size Letter; Author: John Eric Martin; Engineer: John Eric Martin; Organization: UCCS IEEE Robotics; Address1: 1420 Austin Bluffs Pkwy; Address2: Colorado Springs, CO 80918; DocumentNumber: JTAG1; Revision: 1; SheetNumber: 5; SheetTotal: 8; ProjectName: Animated Archer Quadcopter
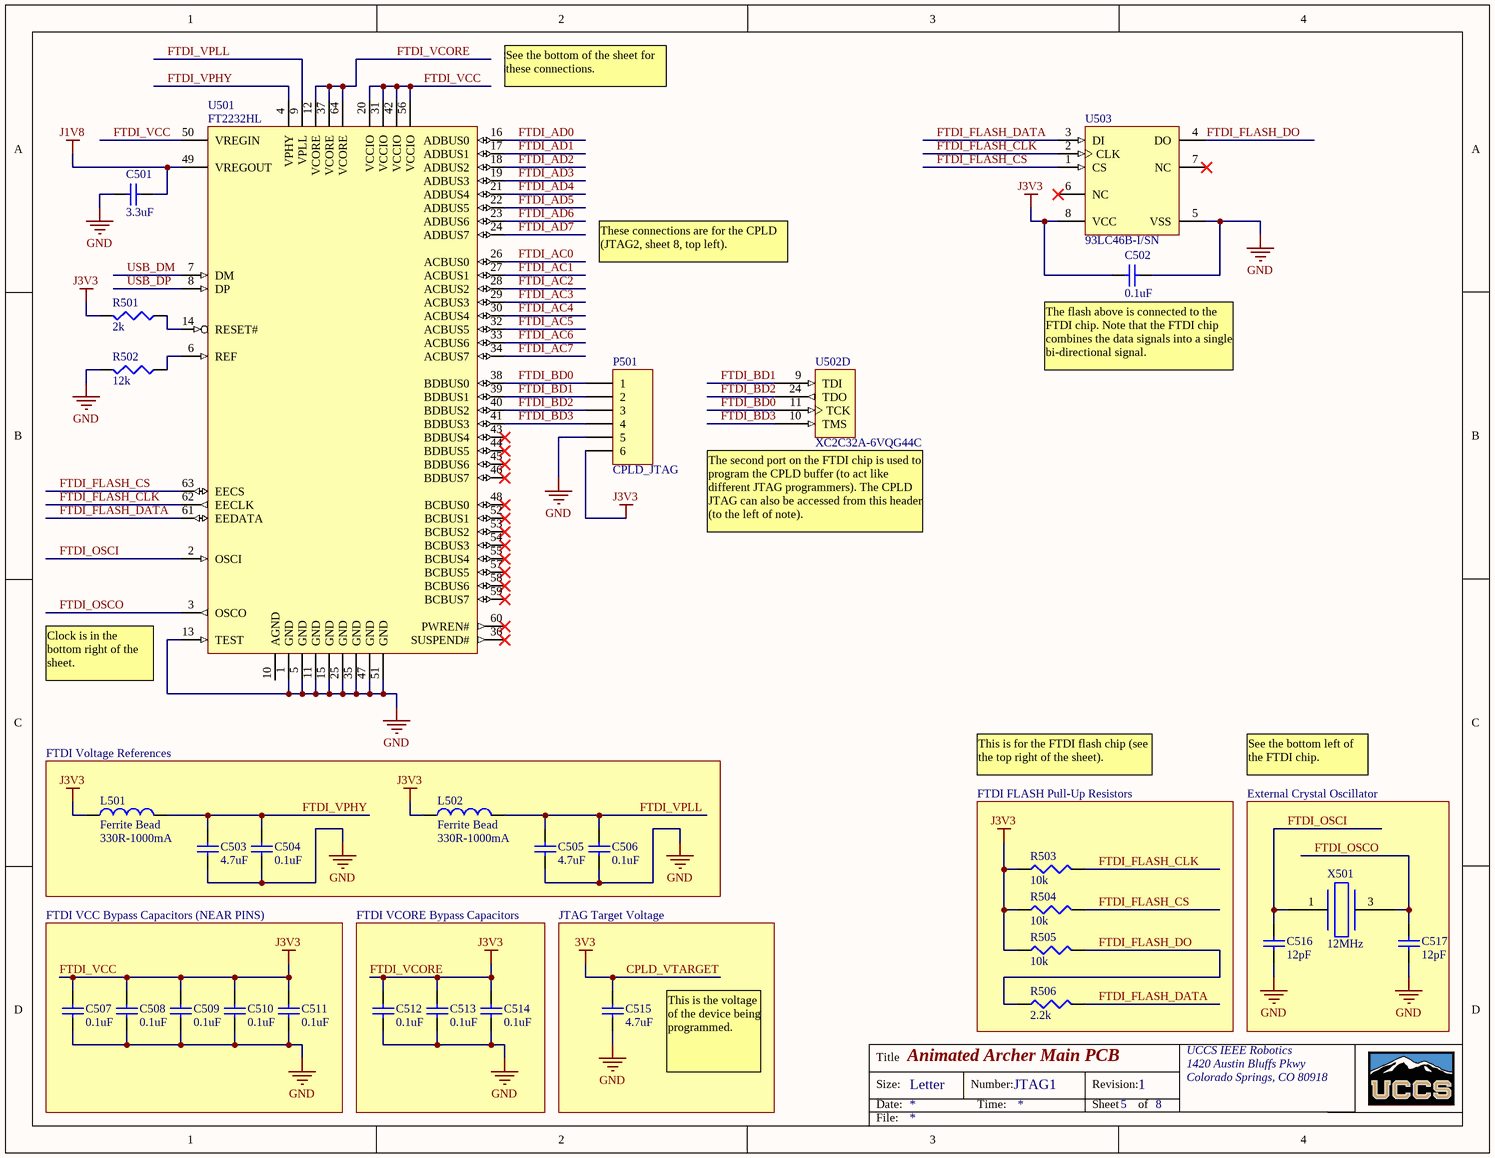
[diagram p4: JTAG1.SchDoc]

### Parts
(Parts that share a designator on the sheet are numbered #1, #2 ... from top to bottom, then left to right.)
C501#2  value 3.3uF  [1608[0603]]  (hidden comment: 0.1uF)
C502#2  0.1uF  [1608[0603]]
C503#2  value 4.7uF  [1608[0603]]  (hidden comment: 0.1uF)
C504#2  0.1uF  [1608[0603]]
C505#2  value 4.7uF  [1608[0603]]  (hidden comment: 0.1uF)
C506#2  0.1uF  [1608[0603]]
C507#2  0.1uF  [1608[0603]]
C508#2  0.1uF  [1608[0603]]
C509#2  0.1uF  [1608[0603]]
C510#2  0.1uF  [1608[0603]]
C511#2  0.1uF  [1608[0603]]
C512#2  0.1uF  [1608[0603]]
C513#2  0.1uF  [1608[0603]]
C514#2  0.1uF  [1608[0603]]
C515#2  value 4.7uF  [1608[0603]]  (hidden comment: 0.1uF)
C516#2  value 12pF  [1608[0603]]  (hidden comment: 0.1uF)
C517#2  value 12pF  [1608[0603]]  (hidden comment: 0.1uF)
L501  Ferrite Bead  value 330R-1000mA  [0603]
L502  Ferrite Bead  value 330R-1000mA  [0603]
P501  CPLD_JTAG  [HDR1X6]
R501#2  value 2k  [J1-0603]  (hidden comment: Res3)
R502#2  value 12k  [J1-0603]  (hidden comment: Res3)
R503#2  value 10k  [J1-0603]  (hidden comment: Res3)
R504  value 10k  [J1-0603]  (hidden comment: Res3)
R505  value 10k  [J1-0603]  (hidden comment: Res3)
R506  value 2.2k  [J1-0603]  (hidden comment: Res3)
U501  FT2232HL  [LQFP-64_N]
U502  XC2C32A-6VQG44C  [VQG44_N]  (part D of 6)
U503  93LC46B-I/SN  [SOIC-SN8_N]
X501  12MHz  [CTS405XTAL]

### Blocks framed on the sheet
FTDI Voltage References: C503#2 C504#2 C505#2 C506#2 L501 L502
FTDI FLASH Pull-Up Resistors: R503#2 R504-R506
External Crystal Oscillator: C516#2 C517#2 X501
FTDI VCC Bypass Capacitors (NEAR PINS): C507#2 C508#2 C509#2 C510#2 C511#2
FTDI VCORE Bypass Capacitors: C512#2 C513#2 C514#2
JTAG Target Voltage: C515#2

### Nets
CPLD_VTARGET: C515#2.2  [also labelled 3V3]
FTDI_VCC: C502#2.2 C507#2.2 C508#2.2 C509#2.2 C510#2.2 C511#2.2 C512#2.2 C513#2.2 C514#2.2 L501.1 L502.1 P501.6 R501#2.2 R503#2.1 R504.1 R505.1 U501.12(VCORE) U501.20(VCCIO) U501.31(VCCIO) U501.37(VCORE) U501.42(VCCIO) U501.50(VREGIN) U501.56(VCCIO) U501.64(VCORE) U503.8(VCC)  [also labelled FTDI_VCORE, J3V3]  [project net CPLD_VCCIN]
GND: C501#2.1 C502#2.1 C503#2.1 C504#2.1 C505#2.1 C506#2.1 C507#2.1 C508#2.1 C509#2.1 C510#2.1 C511#2.1 C512#2.1 C513#2.1 C514#2.1 C515#2.1 C516#2.1 C517#2.1 P501.5 R502#2.2 U501.1(GND) U501.5(GND) U501.11(GND) U501.13(TEST) U501.15(GND) U501.25(GND) U501.35(GND) U501.47(GND) U501.51(GND) U503.5(VSS)  [project net FPGA_SUSPEND]
J1V8: C501#2.2 U501.49(VREGOUT)  [project net CPLD_VCORE]
FTDI_AC0: U501.26(ACBUS0)
FTDI_AC1: U501.27(ACBUS1)
FTDI_AC2: U501.28(ACBUS2)
FTDI_AC3: U501.29(ACBUS3)
FTDI_AC4: U501.30(ACBUS4)
FTDI_AC5: U501.32(ACBUS5)
FTDI_AC6: U501.33(ACBUS6)
FTDI_AC7: U501.34(ACBUS7)
FTDI_AD0: U501.16(ADBUS0)
FTDI_AD1: U501.17(ADBUS1)
FTDI_AD2: U501.18(ADBUS2)
FTDI_AD3: U501.19(ADBUS3)
FTDI_AD4: U501.21(ADBUS4)
FTDI_AD5: U501.22(ADBUS5)
FTDI_AD6: U501.23(ADBUS6)
FTDI_AD7: U501.24(ADBUS7)
FTDI_BD0: P501.1 U501.38(BDBUS0) U502.11(TCK)
FTDI_BD1: P501.2 U501.39(BDBUS1) U502.9(TDI)
FTDI_BD2: P501.3 U501.40(BDBUS2) U502.24(TDO)
FTDI_BD3: P501.4 U501.41(BDBUS3) U502.10(TMS)
FTDI_FLASH_CLK: R503#2.2 U501.62(EECLK) U503.2(CLK)
FTDI_FLASH_CS: R504.2 U501.63(EECS) U503.1(CS)
FTDI_FLASH_DATA: R506.2 U501.61(EEDATA) U503.3(DI)
FTDI_FLASH_DO: R505.2 R506.1 U503.4(DO)
FTDI_OSCI: C516#2.2 U501.2(OSCI) X501.1
FTDI_OSCO: C517#2.2 U501.3(OSCO) X501.3
FTDI_VPHY: C503#2.2 C504#2.2 L501.2 U501.4(VPHY)
FTDI_VPLL: C505#2.2 C506#2.2 L502.2 U501.9(VPLL)
USB_DM: U501.7(DM)
USB_DP: U501.8(DP)
NetR501#2_1: R501#2.1 U501.14(RESET#)
NetR502#2_1: R502#2.1 U501.6(REF)

Not connected (* = marked no-connect by the designer): U501 10(AGND) 36(SUSPEND#)* 43(BDBUS4)* 44(BDBUS5)* 45(BDBUS6)* 46(BDBUS7)* 48(BCBUS0)* 52(BCBUS1)* 53(BCBUS2)* 54(BCBUS3)* 55(BCBUS4)* 57(BCBUS5)* 58(BCBUS6)* 59(BCBUS7)* 60(PWREN#)*; U503 6(NC)* 7(NC)*

### Notes on the sheet
- (near U501) See the bottom of the sheet for these connections.
- These connections are for the CPLD (JTAG2, sheet 8, top left).
- (near C502#2) The flash above is connected to the FTDI chip. Note that the FTDI chip combines the data signals into a single bi-directional signal.
- (near U502) The second port on the FTDI chip is used to program the CPLD buffer (to act like different JTAG programmers). The CPLD JTAG can also be accessed from this header (to the left of note).
- Clock is in the bottom right of the sheet.
- This is for the FTDI flash chip (see the top right of the sheet).
- See the bottom left of the FTDI chip.
- This is the voltage of the device being programmed.
- Title
- Size:
- Date:
- Letter
- Number:
- Time:
- Revision:
- Sheet
- of
- File:

### Library data of the parts
C501#2 C502#2 C503#2 C504#2 C505#2 C506#2 C507#2 C508#2 C509#2 C510#2 C511#2 C512#2 C513#2 C514#2 C515#2 C516#2 C517#2 = Cap Semi: Capacitor (Semiconductor SIM Model); Published: 8-Jun-2000; LatestRevisionDate: 29-May-2009; LatestRevisionNote: IPC-7351 Footprint Added.; PackageReference: C1206; Publisher: Altium Limited; PackageDescription: Chip Capacitor
  C502#2 C504#2 C506#2 C507#2 C508#2 C509#2 C510#2 C511#2 C512#2 C513#2 C514#2: Value: 0.1uF
L501 L502 = Inductor: Code_IEC: 1005; Published: 8-Jun-2000; LatestRevisionDate: 29-May-2009; LatestRevisionNote: IPC-7351 Footprint Added.; PackageReference: 0402-A; Publisher: Altium Limited; PackageDescription: Chip Inductor; Code_JEITA: 0402
P501 = Header 6: Header, 6-Pin; LatestRevisionDate: 17-Jul-2002; LatestRevisionNote: Re-released for DXP Platform.; Publisher: Altium Limited
R501#2 R502#2 R503#2 R504-R506 = Res3: Resistor; Published: 8-Jun-2000; LatestRevisionDate: 29-May-2009; LatestRevisionNote: IPC-7351 Footprint Added.; PackageReference: J1-0603; Publisher: Altium Limited; PackageDescription: Chip Resistor
U501 = FT2232HL: Dual High Speed USB To Multipurpose UART/FIFO IC, LQFP-64, Tape and Reel; Published: 19-Aug-2010; DatasheetVersion: ver 2.08, May-2010; PackageVersion: 2010; PackageReference: LQFP-64; Publisher: Altium Limited; PackageDescription: 64-Pin Thin Quad Flat Pack, 10 x 10 x 1.4 mm Body, 0.5 mm Pitch; ComponentLink1Description: Manufacturer Link; ComponentLink1URL: http://www.ftdichip.com/Products/ICs/FT2232H.htm; ComponentLink2Description: Datasheet; ComponentLink2URL: http://www.ftdichip.com/Support/Documents/DataSheets/ICs/DS_FT2232H.pdf
U502 = XC2C32A-6VQG44C: CoolRunner-II 1.8V, 32 Macrocell CPLD, 33 User I/Os, 44-Pin VQFP, Commercial Grade, Pb-Free; Published: 4-Mar-2005; LatestRevisionDate: 30-Oct-2009; LatestRevisionNote: Updated to datasheet version 3.1 Sep-2008.; DatasheetVersion: ver2.1, Nov-2008; PackageVersion: ver1.2, Jun-2004; PackageReference: VQG44; Publisher: Altium Limited; PackageDescription: 44-Pin Very Thin Quad Flat Pack (VQG44) - Pb-Free; Supplier 1: Digi-Key; Supplier Part Number 1: 122-1404-ND; Code_JEDEC: MS-026-ACB; ComponentLink1Description: XC2C32A Datasheet; ComponentLink1URL: http://www.xilinx.com/support/documentation/data_sheets/ds310.pdf; ComponentLink2Description: Discontinuation Notice; ComponentLink2URL: http://www.xilinx.com/support/documentation/customer_notices/xcn07022.pdf; ComponentLink3Description: VQG44 Package Drawing; ComponentLink3URL: http://www.xilinx.com/support/documentation/package_specs/vq44.pdf; ComponentLink4Description: CoolRunner-II Documents; ComponentLink4URL: http://www.xilinx.com/support/documentation/coolrunner-ii.htm; ComponentLink5Description: Xilinx.com Home; ComponentLink5URL: http://www.xilinx.com
U503 = 93LC46B-I/SN: 1K, 64x16-bit, 2.5V Microwire Serial EEPROM, 8-Pin SOIC 150mil, Industrial Temperature; Published: 29-Jan-2009; DatasheetVersion: revG, May-2008; PackageVersion: revBB, Aug-2009; PackageReference: SOIC-SN8; Publisher: Altium Limited; PackageDescription: 8-Lead Plastic Small Outline (SN) - Narrow, 3.90mm Body [SOIC]; Supplier 1: Digi-Key; Supplier Part Number 1: 93LC46B-I/SN-ND; Supplier 2: Farnell; Supplier Part Number 2: 9758232; Code_JEDEC: MS-012; Code_IPC: SOIC127P600-8; ComponentLink1Description: Datasheet; ComponentLink1URL: http://ww1.microchip.com/downloads/en/DeviceDoc/21749G.pdf; ComponentLink2Description: Packaging Specification; ComponentLink2URL: http://www.microchip.com/stellent/groups/techpub_sg/documents/packagingspec/en012702.pdf; ComponentLink3Description: Microchip.com Home; ComponentLink3URL: http://www.microchip.com/
X501 = CTS405XTAL: as X101 on sheet ARM; Supplier 1: Mouser; Supplier 2: Digi-Key; Supplier 3: Digi-Key; Supplier 4: Arrow; Supplier 5: Digi-Key

## Sheet JTAG2.SchDoc: Animated Archer Main PCB
size Letter; Author: John Eric Martin; Engineer: John Eric Martin; Organization: UCCS IEEE Robotics; Address1: 1420 Austin Bluffs Pkwy; Address2: Colorado Springs, CO 80918; DocumentNumber: JTAG2; Revision: 1; SheetNumber: 8; SheetTotal: 10; ProjectName: Animated Archer Quadcopter
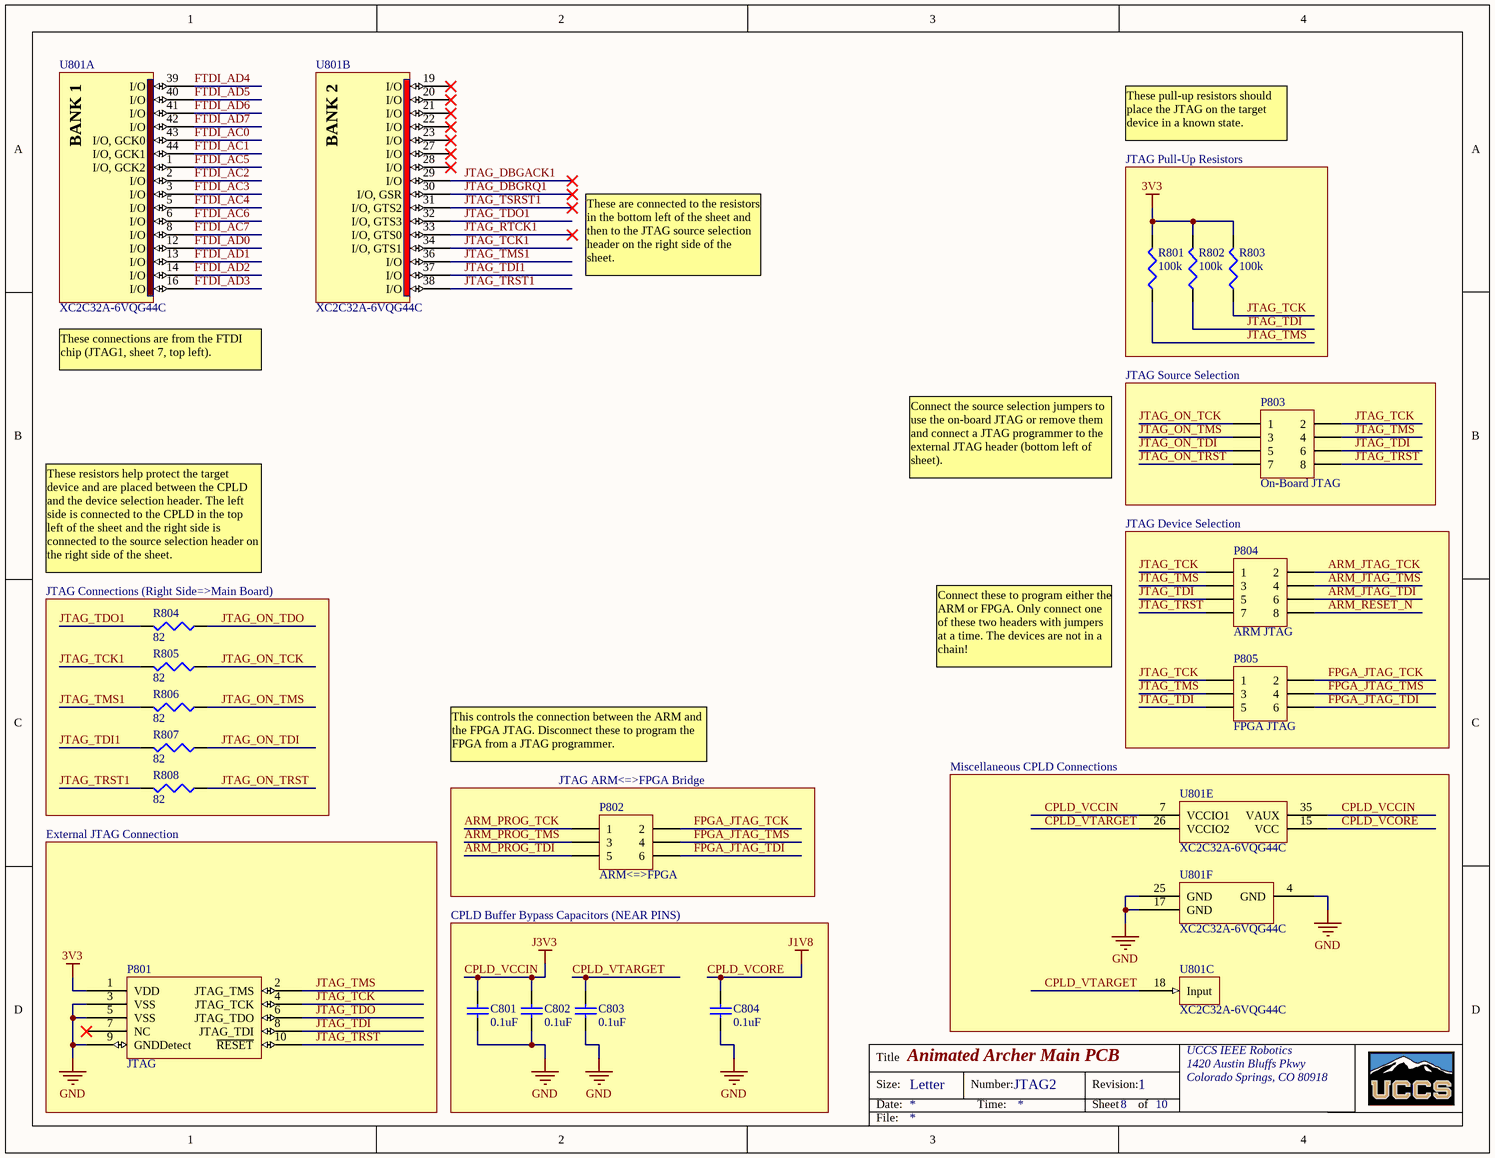
[diagram p5: JTAG2.SchDoc]

### Parts
(Parts that share a designator on the sheet are numbered #1, #2 ... from top to bottom, then left to right.)
C801#1  0.1uF  [1608[0603]]
C802#1  0.1uF  [1608[0603]]
C803#1  0.1uF  [1608[0603]]
C804#1  0.1uF  [1608[0603]]
P801  JTAG  [EZPORT]
P802  ARM<=>FPGA  [HDR2X3]
P803  On-Board JTAG  [HDR2X4]
P804  ARM JTAG  [HDR2X4]
P805  FPGA JTAG  [HDR2X3]
R801  value 100k  [J1-0603]  (hidden comment: Res3)
R802  value 100k  [J1-0603]  (hidden comment: Res3)
R803  value 100k  [J1-0603]  (hidden comment: Res3)
R804  value 82  [J1-0603]  (hidden comment: Res3)
R805  value 82  [J1-0603]  (hidden comment: Res3)
R806  value 82  [J1-0603]  (hidden comment: Res3)
R807  value 82  [J1-0603]  (hidden comment: Res3)
R808  value 82  [J1-0603]  (hidden comment: Res3)
U801#1  XC2C32A-6VQG44C  [VQG44_N]  (parts A,B,C,E,F of 6)

### Blocks framed on the sheet
JTAG Pull-Up Resistors: R801-R803
JTAG Source Selection: P803
JTAG Device Selection: P804 P805
JTAG Connections (Right Side=>Main Board): R804-R808
JTAG ARM<=>FPGA Bridge: P802
Miscellaneous CPLD Connections: U801#1
External JTAG Connection: P801
CPLD Buffer Bypass Capacitors (NEAR PINS): C801#1 C802#1 C803#1 C804#1

### Nets
CPLD_VCCIN: C801#1.2 C802#1.2 U801#1.7(VCCIO1) U801#1.35(VAUX)  [also labelled J3V3]
CPLD_VCORE: C804#1.2 U801#1.15(VCC)  [also labelled J1V8]
CPLD_VTARGET: C803#1.2 P801.1(VDD) R801.2 R802.2 R803.2 U801#1.18(Input) U801#1.26(VCCIO2)  [also labelled 3V3]
GND: C801#1.1 C802#1.1 C803#1.1 C804#1.1 P801.3(VSS) P801.5(VSS) P801.9(GNDDetect) U801#1.4(GND) U801#1.17(GND) U801#1.25(GND)  [project net FPGA_SUSPEND]
ARM_JTAG_TCK: P804.2
ARM_JTAG_TDI: P804.6
ARM_JTAG_TMS: P804.4
ARM_PROG_TCK: P802.1
ARM_PROG_TDI: P802.5
ARM_PROG_TMS: P802.3
ARM_RESET_N: P804.8
FPGA_JTAG_TCK: P802.2 P805.2
FPGA_JTAG_TDI: P802.6 P805.6
FPGA_JTAG_TMS: P802.4 P805.4
FTDI_AC0: U801#1.43(I/O,_GCK0)
FTDI_AC1: U801#1.44(I/O,_GCK1)
FTDI_AC2: U801#1.2(I/O)
FTDI_AC3: U801#1.3(I/O)
FTDI_AC4: U801#1.5(I/O)
FTDI_AC5: U801#1.1(I/O,_GCK2)
FTDI_AC6: U801#1.6(I/O)
FTDI_AC7: U801#1.8(I/O)
FTDI_AD0: U801#1.12(I/O)
FTDI_AD1: U801#1.13(I/O)
FTDI_AD2: U801#1.14(I/O)
FTDI_AD3: U801#1.16(I/O)
FTDI_AD4: U801#1.39(I/O)
FTDI_AD5: U801#1.40(I/O)
FTDI_AD6: U801#1.41(I/O)
FTDI_AD7: U801#1.42(I/O)
JTAG_DBGACK1: U801#1.29(I/O)
JTAG_DBGRQ1: U801#1.30(I/O,_GSR)
JTAG_ON_TCK: P803.1 R805.1
JTAG_ON_TDI: P803.5 R807.1
JTAG_ON_TDO: R804.1
JTAG_ON_TMS: P803.3 R806.1
JTAG_ON_TRST: P803.7 R808.1
JTAG_RTCK1: U801#1.33(I/O,_GTS0)
JTAG_TCK: P801.4(JTAG_TCK) P803.2 P804.1 P805.1 R803.1
JTAG_TCK1: R805.2 U801#1.34(I/O,_GTS1)
JTAG_TDI: P801.8(JTAG_TDI) P803.6 P804.5 P805.5 R802.1
JTAG_TDI1: R807.2 U801#1.37(I/O)
JTAG_TDO: P801.6(JTAG_TDO)
JTAG_TDO1: R804.2 U801#1.32(I/O,_GTS3)
JTAG_TMS: P801.2(JTAG_TMS) P803.4 P804.3 P805.3 R801.1
JTAG_TMS1: R806.2 U801#1.36(I/O)
JTAG_TRST: P801.10(~{RESET}) P803.8 P804.7
JTAG_TRST1: R808.2 U801#1.38(I/O)
JTAG_TSRST1: U801#1.31(I/O,_GTS2)

Not connected (* = marked no-connect by the designer): P801 7(NC)*; U801#1 19(I/O)* 20(I/O)* 21(I/O)* 22(I/O)* 23(I/O)* 27(I/O)* 28(I/O)*

### Notes on the sheet
- These pull-up resistors should place the JTAG on the target device in a known state.
- These are connected to the resistors in the bottom left of the sheet and then to the JTAG source selection header on the right side of the sheet.
- (near U801#1) These connections are from the FTDI chip (JTAG1, sheet 7, top left).
- Connect the source selection jumpers to use the on-board JTAG or remove them and connect a JTAG programmer to the external JTAG header (bottom left of sheet).
- These resistors help protect the target device and are placed between the CPLD and the device selection header. The left side is connected to the CPLD in the top left of the sheet and the right side is connected to the source selection header on the right side of the sheet.
- Connect these to program either the ARM or FPGA. Only connect one of these two headers with jumpers at a time. The devices are not in a chain!
- This controls the connection between the ARM and the FPGA JTAG. Disconnect these to program the FPGA from a JTAG programmer.
- Title
- Size:
- Date:
- Letter
- Number:
- Time:
- Revision:
- Sheet
- of
- File:
- (in symbol XC2C32A-6VQG44C, part A) BANK 1
- (in symbol XC2C32A-6VQG44C, part B) BANK 2

### Library data of the parts
C801#1 C802#1 C803#1 C804#1 = Cap Semi: Capacitor (Semiconductor SIM Model); Published: 8-Jun-2000; LatestRevisionDate: 29-May-2009; LatestRevisionNote: IPC-7351 Footprint Added.; PackageReference: C1206; Publisher: Altium Limited; PackageDescription: Chip Capacitor; Value: 0.1uF
P801 = Debug Interface: 10-pin Freescale Debug Interface; LatestRevisionDate: 17-Jul-2002; LatestRevisionNote: Re-released for DXP Platform.; Publisher: Altium Limited
P802 P805 = Header 3X2: Header, 3-Pin, Dual row; LatestRevisionDate: 17-Jul-2002; LatestRevisionNote: Re-released for DXP Platform.; Publisher: Altium Limited
P803 P804 = Header 4X2: Header, 4-Pin, Dual row; LatestRevisionDate: 17-Jul-2002; LatestRevisionNote: Re-released for DXP Platform.; Publisher: Altium Limited
R801-R808 = Res3: Resistor; Published: 8-Jun-2000; LatestRevisionDate: 29-May-2009; LatestRevisionNote: IPC-7351 Footprint Added.; PackageReference: J1-0603; Publisher: Altium Limited; PackageDescription: Chip Resistor
U801#1 = XC2C32A-6VQG44C: as U502 on sheet JTAG1; Published: 4-Mar-2005; LatestRevisionDate: 30-Oct-2009; LatestRevisionNote: Updated to datasheet version 3.1 Sep-2008.; DatasheetVersion: ver2.1, Nov-2008; PackageVersion: ver1.2, Jun-2004; PackageReference: VQG44; Publisher: Altium Limited; PackageDescription: 44-Pin Very Thin Quad Flat Pack (VQG44) - Pb-Free; Supplier 1: Digi-Key; Supplier Part Number 1: 122-1404-ND; Code_JEDEC: MS-026-ACB; ComponentLink1Description: XC2C32A Datasheet; ComponentLink1URL: http://www.xilinx.com/support/documentation/data_sheets/ds310.pdf; ComponentLink2Description: Discontinuation Notice; ComponentLink2URL: http://www.xilinx.com/support/documentation/customer_notices/xcn07022.pdf; ComponentLink3Description: VQG44 Package Drawing; ComponentLink3URL: http://www.xilinx.com/support/documentation/package_specs/vq44.pdf; ComponentLink4Description: CoolRunner-II Documents; ComponentLink4URL: http://www.xilinx.com/support/documentation/coolrunner-ii.htm; ComponentLink5Description: Xilinx.com Home; ComponentLink5URL: http://www.xilinx.com

## Sheet POWER.SchDoc: Animated Archer Main PCB
size Letter; Author: John Eric Martin; Engineer: John Eric Martin; Organization: UCCS IEEE Robotics; Address1: 1420 Austin Bluffs Pkwy; Address2: Colorado Springs, CO 80918; DocumentNumber: POWER; Revision: 1; SheetNumber: 7; SheetTotal: 8; ProjectName: Animated Archer Quadcopter
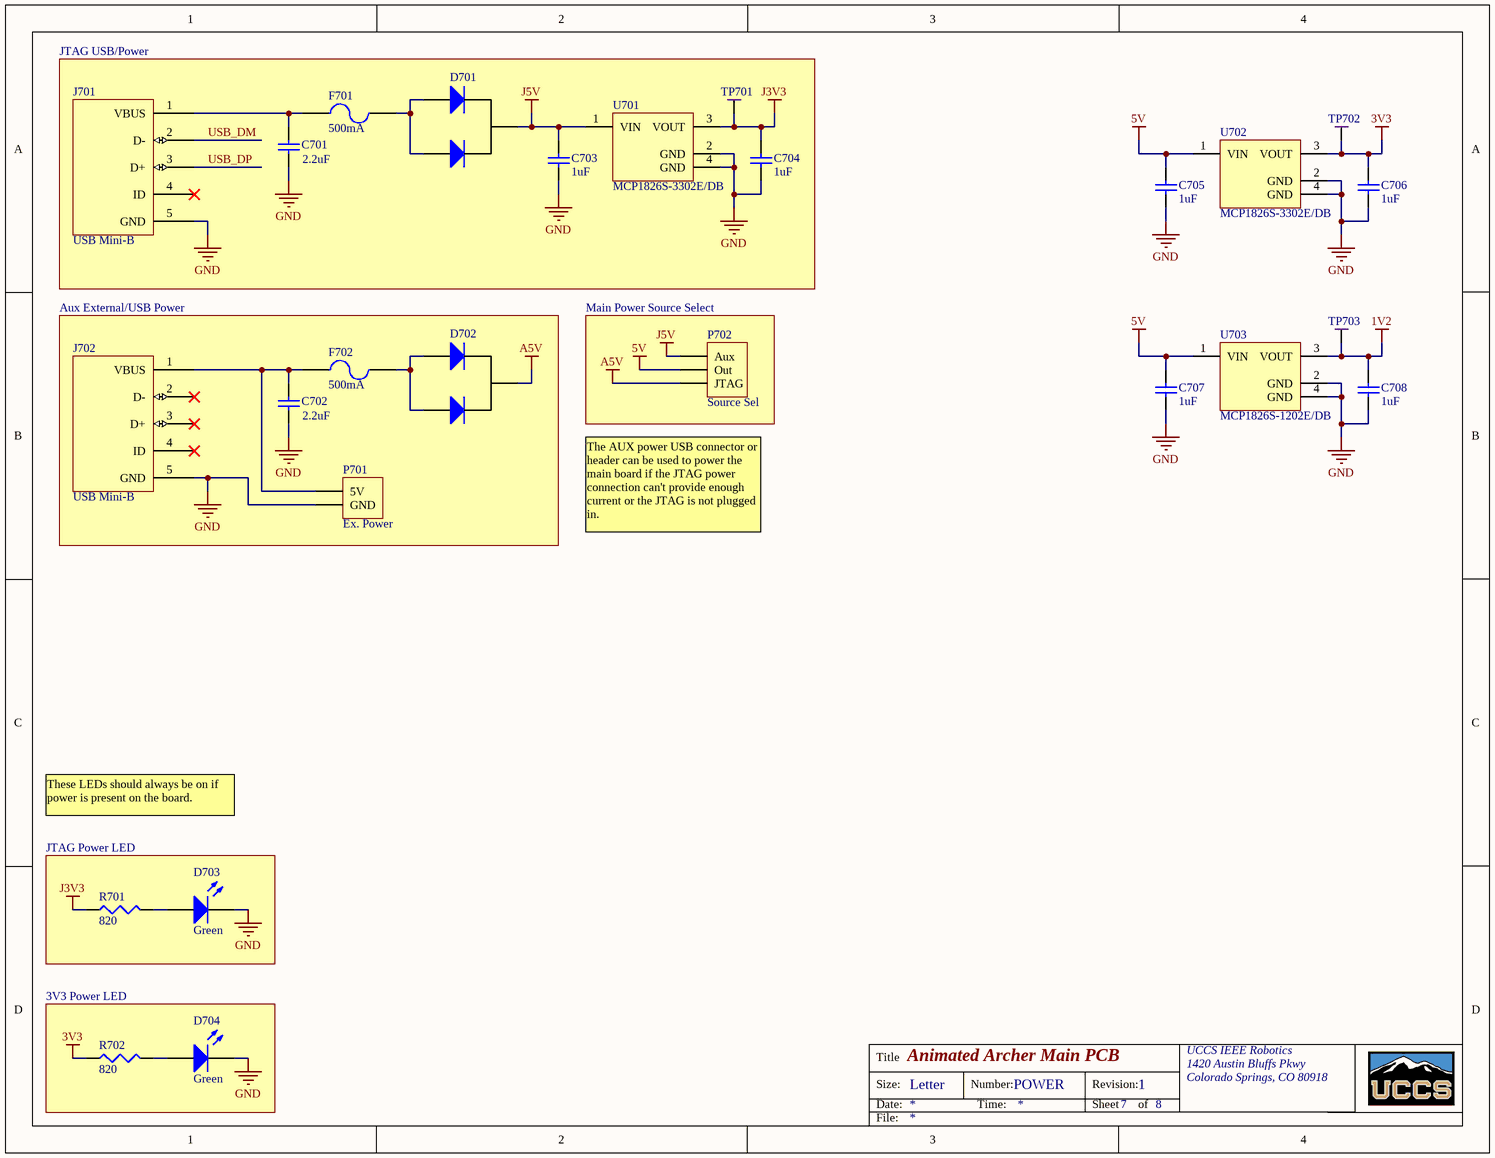
[diagram p6: POWER.SchDoc]

### Parts
C701  value 2.2uF  [1608[0603]]  (hidden comment: Cap Semi)
C702  value 2.2uF  [1608[0603]]  (hidden comment: Cap Semi)
C703  value 1uF  [1608[0603]]  (hidden comment: 0.1uF)
C704  value 1uF  [1608[0603]]  (hidden comment: 0.1uF)
C705  value 1uF  [1608[0603]]  (hidden comment: 0.1uF)
C706  value 1uF  [1608[0603]]  (hidden comment: 0.1uF)
C707  value 1uF  [1608[0603]]  (hidden comment: 0.1uF)
C708  value 1uF  [1608[0603]]  (hidden comment: 0.1uF)
D701  HSMS-2804-BLKG  [SOT-23_N]  (value not drawn)
D702  HSMS-2804-BLKG  [SOT-23_N]  (value not drawn)
D703  Green  [1608[0603]]
D704  Green  [1608[0603]]
F701  500mA  [C0805]
F702  500mA  [C0805]
J701  USB Mini-B  [54819-0572]
J702  USB Mini-B  [54819-0572]
P701  Ex. Power  [HDR1X2]
P702  Source Sel  [HDR1X3]
R701  value 820  [J1-0603]  (hidden comment: Res3)
R702  value 820  [J1-0603]  (hidden comment: Res3)
TP701  Test Point  [TESTPT]  (value not drawn)
TP702  Test Point  [TESTPT]  (value not drawn)
TP703  Test Point  [TESTPT]  (value not drawn)
U701  MCP1826S-3302E/DB  [SOT-223-DB3_N]
U702  MCP1826S-3302E/DB  [SOT-223-DB3_N]
U703  MCP1826S-1202E/DB  [SOT-223-DB3_N]

### Blocks framed on the sheet
JTAG USB/Power: C701 C703 C704 D701 F701 J701 TP701 U701
Aux External/USB Power: C702 D702 F702 J702 P701
Main Power Source Select: P702
JTAG Power LED: D703 R701
3V3 Power LED: D704 R702

### Nets
1V2: C708.2 TP703.1 U703.3(VOUT)  [project net FPGA_VCCINT]
3V3: C706.2 R702.1 TP702.1 U702.3(VOUT)  [project net CPLD_VTARGET]
5V: C705.2 C707.2 P702.2(Out) U702.1(VIN) U703.1(VIN)
A5V: D702.3(K) P702.3(JTAG)
GND: C701.2 C702.2 C703.1 C704.1 C705.1 C706.1 C707.1 C708.1 D703.2(K) D704.2(K) J701.5(GND) J702.5(GND) P701.2(GND) U701.2(GND) U701.4(GND) U702.2(GND) U702.4(GND) U703.2(GND) U703.4(GND)  [project net FPGA_SUSPEND]
J3V3: C704.2 R701.1 TP701.1 U701.3(VOUT)  [project net CPLD_VCCIN]
J5V: C703.2 D701.3(K) P702.1(Aux) U701.1(VIN)
USB_DM: J701.2(D-)
USB_DP: J701.3(D+)
NetC701_1: C701.1 F701.2 J701.1(VBUS)
NetC702_1: C702.1 F702.2 J702.1(VBUS) P701.1(5V)
NetD701_1: D701.1(A) D701.2(B) F701.1
NetD702_1: D702.1(A) D702.2(B) F702.1
NetD703_1: D703.1(A) R701.2
NetD704_1: D704.1(A) R702.2

Not connected (* = marked no-connect by the designer): J701 4(ID)* 6(CASE); J702 2(D-)* 3(D+)* 4(ID)* 6(CASE)

### Notes on the sheet
- The AUX power USB connector or header can be used to power the main board if the JTAG power connection can't provide enough current or the JTAG is not plugged in.
- These LEDs should always be on if power is present on the board.
- Title
- Size:
- Date:
- Letter
- Number:
- Time:
- Revision:
- Sheet
- of
- File:

### Library data of the parts
C701-C708 = Cap Semi: Capacitor (Semiconductor SIM Model); Published: 8-Jun-2000; LatestRevisionDate: 29-May-2009; LatestRevisionNote: IPC-7351 Footprint Added.; PackageReference: C1206; Publisher: Altium Limited; PackageDescription: Chip Capacitor
D701 D702 = HSMS-2804-BLKG: Dual Common Cathode Schottky Diode; Note: Pin 2 is not connected and not drawn.; Published: 21-Mar-2003; LatestRevisionDate: 29-May-2009; LatestRevisionNote: IPC-7351 Footprint Added.; DatasheetVersion: Oct-1999; PackageVersion: Sep-2001; PackageReference: SOT-23; Publisher: Altium Limited; PackageDescription: 3-Pin SOT-23 Package 0.95 mm Pitch, 2.5 mm Lead Span; ComponentLink1Description: Manufacturer Link; ComponentLink1URL: http://www.infineon.com/
D703 D704 = LED2: as D201 on sheet ARM; Published: 8-Jun-2000; LatestRevisionDate: 17-Jul-2002; LatestRevisionNote: Re-released for DXP Platform.; PackageVersion: Feb-2002; PackageReference: 3.2X1.6X1.1; Publisher: Altium Limited; PackageDescription: SM LED; 2 Flat Leads
F701 F702 = Fuse 2: PTC Resettable Fuse; Published: 8-Jun-2000; LatestRevisionDate: 17-Jul-2002; LatestRevisionNote: Re-released for DXP Platform.; PackageReference: PIN-W2/E2.8; Publisher: Altium Limited; PackageDescription: Thru-Hole; 2 Leads
J701 J702 = USB Mini-B: 54819-0572
P701 = Header 2: Header, 2-Pin; LatestRevisionDate: 17-Jul-2002; LatestRevisionNote: Re-released for DXP Platform.; Publisher: Altium Limited
P702 = Header 3: Header, 3-Pin; LatestRevisionDate: 17-Jul-2002; LatestRevisionNote: Re-released for DXP Platform.; Publisher: Altium Limited
R701 R702 = Res3: Resistor; Published: 8-Jun-2000; LatestRevisionDate: 29-May-2009; LatestRevisionNote: IPC-7351 Footprint Added.; PackageReference: J1-0603; Publisher: Altium Limited; PackageDescription: Chip Resistor
U701 U702 = MCP1826S-3302E/DB: 1000 mA, Low Voltage, Low Quiescent Current LDO Regulator, 3-Pin SOT-223, Extended Temperature; Published: 29-Jan-2009; DatasheetVersion: revA, Aug-2007; PackageVersion: revBB, Aug-2009; PackageReference: SOT-223-DB3; Publisher: Altium Limited; PackageDescription: 3-Lead Plastic Small Outline Transistor (DB) [SOT-223]; Supplier 1: Digi-Key; Supplier Part Number 1: MCP1826S-3302E/DB-ND; Supplier 2: Farnell; Supplier Part Number 2: 1578424; ComponentLink1Description: Datasheet; ComponentLink1URL: http://ww1.microchip.com/downloads/en/DeviceDoc/22057a.pdf; ComponentLink2Description: Packaging Specification; ComponentLink2URL: http://www.microchip.com/stellent/groups/techpub_sg/documents/packagingspec/en012702.pdf; ComponentLink3Description: Microchip.com Home; ComponentLink3URL: http://www.microchip.com/
U703 = MCP1826S-1202E/DB: 1000 mA, Low Voltage, Low Quiescent Current LDO Regulator, 3-Pin SOT-223, Extended Temperature; Published: 29-Jan-2009; DatasheetVersion: revA, Aug-2007; PackageVersion: revBB, Aug-2009; PackageReference: SOT-223-DB3; Publisher: Altium Limited; PackageDescription: 3-Lead Plastic Small Outline Transistor (DB) [SOT-223]; Supplier 1: Digi-Key; Supplier Part Number 1: MCP1826S-1202E/DB-ND; ComponentLink1Description: Datasheet; ComponentLink1URL: http://ww1.microchip.com/downloads/en/DeviceDoc/22057a.pdf; ComponentLink2Description: Packaging Specification; ComponentLink2URL: http://www.microchip.com/stellent/groups/techpub_sg/documents/packagingspec/en012702.pdf; ComponentLink3Description: Microchip.com Home; ComponentLink3URL: http://www.microchip.com/

## Sheet SRAM.SchDoc: Animated Archer Main PCB
size Letter; Author: John Eric Martin; Engineer: John Eric Martin; Organization: UCCS IEEE Robotics; Address1: 1420 Austin Bluffs Pkwy; Address2: Colorado Springs, CO 80918; DocumentNumber: SRAM; Revision: 1; SheetNumber: 8; SheetTotal: 8; ProjectName: Animated Archer Quadcopter
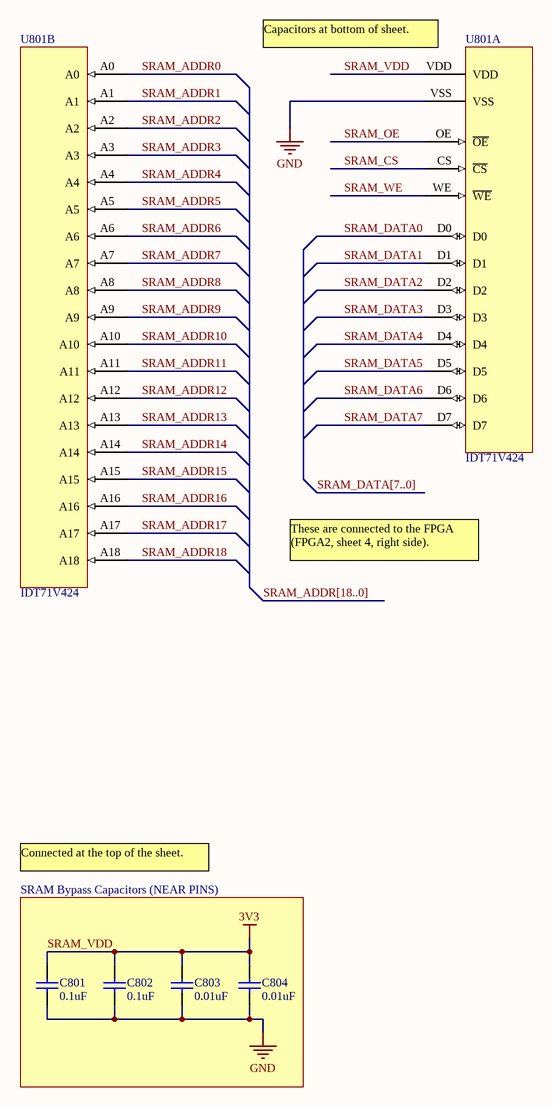
[diagram p7: SRAM.SchDoc]

### Parts
(Parts that share a designator on the sheet are numbered #1, #2 ... from top to bottom, then left to right.)
C801#2  0.1uF  [1608[0603]]
C802#2  0.1uF  [1608[0603]]
C803#2  value 0.01uF  [1608[0603]]  (hidden comment: 0.1uF)
C804#2  value 0.01uF  [1608[0603]]  (hidden comment: 0.1uF)
U801#2  IDT71V424  [IDT-TSOP-44]  (parts A,B of 2)

### Blocks framed on the sheet
SRAM Bypass Capacitors (NEAR PINS): C801#2 C802#2 C803#2 C804#2

### Nets
3V3: C801#2.2 C802#2.2 C803#2.2 C804#2.2 U801#2.VDD  [also labelled SRAM_VDD]  [project net CPLD_VTARGET]
GND: C801#2.1 C802#2.1 C803#2.1 C804#2.1 U801#2.VSS  [project net FPGA_SUSPEND]
SRAM_ADDR0: U801#2.A0
SRAM_ADDR1: U801#2.A1
SRAM_ADDR2: U801#2.A2
SRAM_ADDR3: U801#2.A3
SRAM_ADDR4: U801#2.A4
SRAM_ADDR5: U801#2.A5
SRAM_ADDR6: U801#2.A6
SRAM_ADDR7: U801#2.A7
SRAM_ADDR8: U801#2.A8
SRAM_ADDR9: U801#2.A9
SRAM_ADDR10: U801#2.A10
SRAM_ADDR11: U801#2.A11
SRAM_ADDR12: U801#2.A12
SRAM_ADDR13: U801#2.A13
SRAM_ADDR14: U801#2.A14
SRAM_ADDR15: U801#2.A15
SRAM_ADDR16: U801#2.A16
SRAM_ADDR17: U801#2.A17
SRAM_ADDR18: U801#2.A18
SRAM_CS: U801#2.CS(~{CS})
SRAM_DATA0: U801#2.D0
SRAM_DATA1: U801#2.D1
SRAM_DATA2: U801#2.D2
SRAM_DATA3: U801#2.D3
SRAM_DATA4: U801#2.D4
SRAM_DATA5: U801#2.D5
SRAM_DATA6: U801#2.D6
SRAM_DATA7: U801#2.D7
SRAM_OE: U801#2.OE(~{OE})
SRAM_WE: U801#2.WE(~{WE})

### Buses and harness runs
bus SRAM_ADDR[18..0]
bus SRAM_DATA[7..0]

### Notes on the sheet
- (near U801#2) Capacitors at bottom of sheet.
- These are connected to the FPGA (FPGA2, sheet 4, right side).
- Connected at the top of the sheet.
- Title
- Size:
- Date:
- Letter
- Number:
- Time:
- Revision:
- Sheet
- of
- File:

### Library data of the parts
C801#2 C802#2 C803#2 C804#2 = Cap Semi: Capacitor (Semiconductor SIM Model); Published: 8-Jun-2000; LatestRevisionDate: 29-May-2009; LatestRevisionNote: IPC-7351 Footprint Added.; PackageReference: C1206; Publisher: Altium Limited; PackageDescription: Chip Capacitor
  C801#2 C802#2: Value: 0.1uF
U801#2 = IDT71V424: IDT 3.3V CMOS Static RAM 4 Meg (512K x 8-Bit)